# Altium project Capstone_SDR_PLUTOV2.PrjPcb (part 1 of 3)
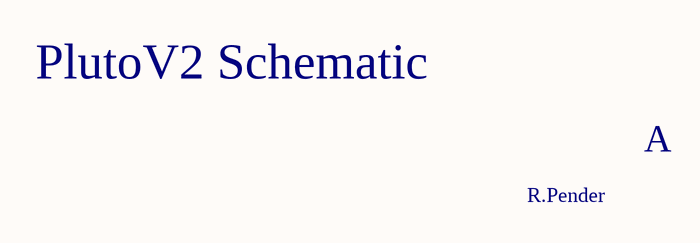
[diagram p0: Cover.SchDoc]
14 sheets, 439 parts. Net scope: global (net labels, ports and power ports of the same name join across sheets).
Sheets:
  Cover.SchDoc
  USB.SchDoc
  DDR3.SchDoc
  ZYNQ JTAG and Decoupling.SchDoc
  ZYNQ 34_35 and QPSI.SchDoc
  AD9363.SchDoc
  RF FRONTEND.SchDoc
  CONNECTORS_SELECTORS.SchDoc
  POWERREG.SchDoc
  POWERMANAGE.SchDoc
  POWERMANAGE2.SchDoc
  TESTPOINTS.SchDoc
  AD9363 OSCILLATORS.SchDoc
  RF Frontend 2.SchDoc

## Sheet Cover.SchDoc
size A3; SheetNumber: 1; SheetTotal: 2

### Notes on the sheet
- PlutoV2 Schematic
- A
- R.Pender

## Sheet USB.SchDoc
size A3; SheetNumber: 2; SheetTotal: 14; SPICEModelCacheQEWUXKYK: <root> / <DocumentId>QEWUXKYK</DocumentId> / </root>
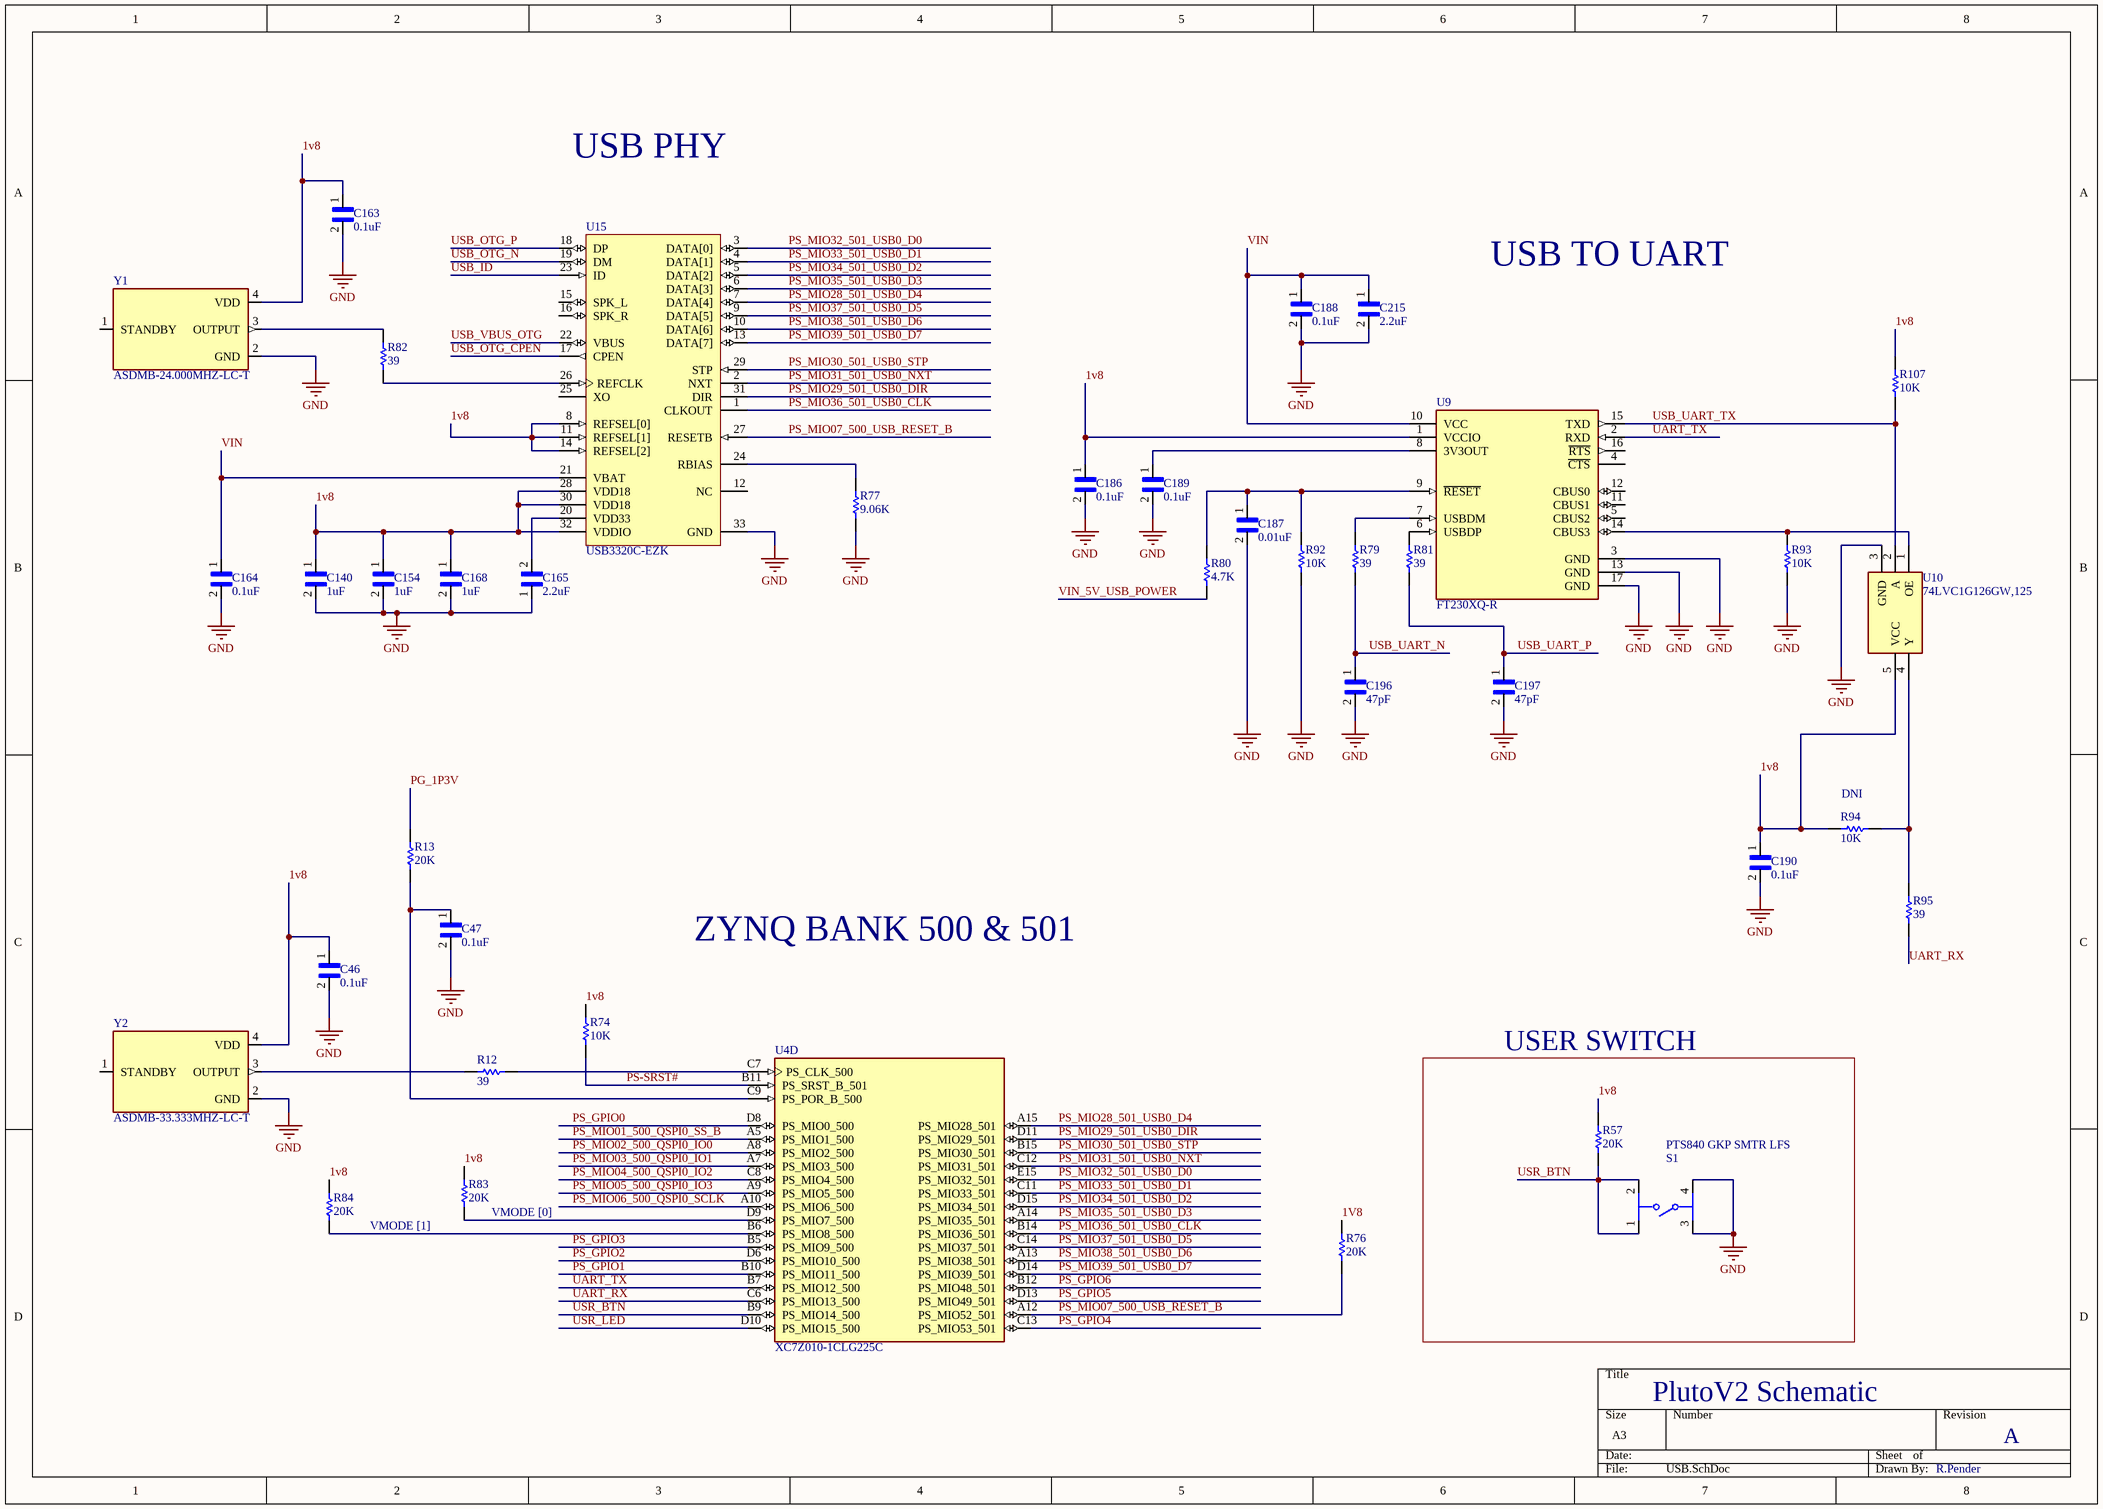
[diagram p1: USB.SchDoc]

### Parts
C46  0.1uF  [CAPC0603X33N]
C47  0.1uF  [CAPC0603X33N]
C140  1uF  [CAPC1005X55N]
C154  1uF  [CAPC1005X55N]
C163  0.1uF  [CAPC0603X33N]
C164  0.1uF  [CAPC0603X33N]
C165  2.2uF  [CAPC1608X100N]
C168  1uF  [CAPC1005X55N]
C186  0.1uF  [CAPC1005X55N]
C187  0.01uF  [CAPC0603X33N]
C188  0.1uF  [CAPC0603X33N]
C189  0.1uF  [CAPC0603X33N]
C190  0.1uF  [CAPC0603X33N]
C196  47pF  [CAPC1005X55N]
C197  47pF  [CAPC1005X55N]
C215  2.2uF  [CAPC1608X100N]
R12  39  [2-0402]
R13  20K  [2-0402]
R57  20K  [2-0402]
R74  10K  [2-0402]
R76  20K  [2-0402]
R77  9.06K  [2-0402]
R79  39  [2-0402]
R80  4.7K  [2-0402]
R81  39  [2-0402]
R82  39  [2-0402]
R83  20K  [2-0402]
R84  20K  [2-0402]
R92  10K  [2-0402]
R93  10K  [2-0402]
R94  10K  [2-0402]
R95  39  [2-0402]
R107  10K  [2-0402]
S1  PTS840 GKP SMTR LFS  [FP-PTS840_GKP_SMTR_LFS-MFG]
U4  XC7Z010-1CLG225C  [BGA225C80P15X15_1300X1300X150]  (part D of 6)
U9  FT230XQ-R  [FP-QFN-16-MFG]
U10  74LVC1G126GW,125  [SOT65P212X110-5N]
U15  USB3320C-EZK  [MCHP-QFN-32-5x5_V2]
Y1  ASDMB-24.000MHZ-LC-T  [XTAL_ASDMB-24.000MHZ-LC-T]
Y2  ASDMB-33.333MHZ-LC-T  [XTAL_ASDMB-24.000MHZ-LC-T]

### Blocks framed on the sheet
USER SWITCH: R57 S1

### Nets
GND: C46.2 C47.2 C140.2 C154.2 C163.2 C164.2 C165.1 C168.2 C186.2 C187.2 C188.2 C189.2 C190.2 C196.2 C197.2 C215.2 R77.1 R92.1 R93.2 S1.3 S1.4 U9.3(GND) U9.13(GND) U9.17(GND) U10.3(GND) U15.33(GND) Y1.2(GND) Y2.2(GND)
1v8: C46.1 C140.1 C154.1 C163.1 C168.1 C186.1 C190.1 R57.1 R74.2 R76.2 R83.1 R84.1 R94.2 R107.1 U9.1(VCCIO) U10.5(VCC) U15.8(REFSEL[0]) U15.11(REFSEL[1]) U15.14(REFSEL[2]) U15.28(VDD18) U15.30(VDD18) U15.32(VDDIO) Y1.4(VDD) Y2.4(VDD)
PG_1P3V: R13.2
PS-SRST#: R74.1 U4.B11(PS_SRST_B_501)
PS_GPIO0: U4.D8(PS_MIO0_500)
PS_GPIO1: U4.B10(PS_MIO11_500)
PS_GPIO2: U4.D6(PS_MIO10_500)
PS_GPIO3: U4.B5(PS_MIO9_500)
PS_GPIO4: U4.C13(PS_MIO53_501)
PS_GPIO5: U4.D13(PS_MIO49_501)
PS_GPIO6: U4.B12(PS_MIO48_501)
PS_MIO01_500_QSPI0_SS_B: U4.A5(PS_MIO1_500)
PS_MIO02_500_QSPI0_IO0: U4.A8(PS_MIO2_500)
PS_MIO03_500_QSPI0_IO1: U4.A7(PS_MIO3_500)
PS_MIO04_500_QSPI0_IO2: U4.C8(PS_MIO4_500)
PS_MIO05_500_QSPI0_IO3: U4.A9(PS_MIO5_500)
PS_MIO06_500_QSPI0_SCLK: U4.A10(PS_MIO6_500)
PS_MIO07_500_USB_RESET_B: R76.1 U4.A12(PS_MIO52_501) U15.27(RESETB)
PS_MIO28_501_USB0_D4: U4.A15(PS_MIO28_501) U15.7(DATA[4])
PS_MIO29_501_USB0_DIR: U4.D11(PS_MIO29_501) U15.31(DIR)
PS_MIO30_501_USB0_STP: U4.B15(PS_MIO30_501) U15.29(STP)
PS_MIO31_501_USB0_NXT: U4.C12(PS_MIO31_501) U15.2(NXT)
PS_MIO32_501_USB0_D0: U4.E15(PS_MIO32_501) U15.3(DATA[0])
PS_MIO33_501_USB0_D1: U4.C11(PS_MIO33_501) U15.4(DATA[1])
PS_MIO34_501_USB0_D2: U4.D15(PS_MIO34_501) U15.5(DATA[2])
PS_MIO35_501_USB0_D3: U4.A14(PS_MIO35_501) U15.6(DATA[3])
PS_MIO36_501_USB0_CLK: U4.B14(PS_MIO36_501) U15.1(CLKOUT)
PS_MIO37_501_USB0_D5: U4.C14(PS_MIO37_501) U15.9(DATA[5])
PS_MIO38_501_USB0_D6: U4.A13(PS_MIO38_501) U15.10(DATA[6])
PS_MIO39_501_USB0_D7: U4.D14(PS_MIO39_501) U15.13(DATA[7])
UART_RX: R95.2 U4.C6(PS_MIO13_500)
UART_TX: U4.B7(PS_MIO12_500) U9.2(RXD)
USB_ID: U15.23(ID)
USB_OTG_CPEN: U15.17(CPEN)
USB_OTG_N: U15.19(DM)
USB_OTG_P: U15.18(DP)
USB_UART_N: C196.1 R79.2
USB_UART_P: C197.1 R81.1
USB_UART_TX: R107.2 U9.15(TXD) U10.2(A)
USB_VBUS_OTG: U15.22(VBUS)
USR_BTN: R57.2 S1.1 S1.2 U4.B9(PS_MIO14_500)
USR_LED: U4.D10(PS_MIO15_500)
VIN: C164.1 C188.1 C215.1 U9.10(VCC) U15.21(VBAT)
VIN_5V_USB_POWER: R80.1
NetC47_1: C47.1 R13.1 U4.C9(PS_POR_B_500)
NetC165_2: C165.2 U15.20(VDD33)
NetC187_1: C187.1 R80.2 R92.2 U9.9(~{RESET})
NetC189_1: C189.1 U9.8(3V3OUT)
NetR12_1: R12.1 Y2.3(OUTPUT)
NetR12_2: R12.2 U4.C7(PS_CLK_500)
NetR77_2: R77.2 U15.24(RBIAS)
NetR79_1: R79.1 U9.7(USBDM)
NetR81_2: R81.2 U9.6(USBDP)
NetR82_1: R82.1 U15.26(REFCLK)
NetR82_2: R82.2 Y1.3(OUTPUT)
NetR83_2: R83.2 U4.D9(PS_MIO7_500)
NetR84_2: R84.2 U4.B6(PS_MIO8_500)
NetR93_1: R93.1 U9.14(CBUS3) U10.1(OE)
NetR94_1: R94.1 R95.1 U10.4(Y)

Not connected (* = marked no-connect by the designer): U9 4(~{CTS}) 5(CBUS2) 11(CBUS1) 12(CBUS0) 16(~{RTS}); U15 12(NC) 15(SPK_L) 16(SPK_R) 25(XO); Y1 1(STANDBY); Y2 1(STANDBY)

### Notes on the sheet
- USB PHY
- USB TO UART
- (near R94) DNI
- ZYNQ BANK 500 & 501
- VMODE [1]
- (near R83) VMODE [0]
- PlutoV2 Schematic
- A
- R.Pender

### Library data of the parts
C46 C47 C163 C164 C188-C190 = GRM033R61C104ME84D: CAP 0.1UF 16VDC X5R 20% SMD 0201 PAPER TAPE; Package: None; Price: None; Value: *; MP: GRM033R61C104ME84D; Availability: Unavailable
C140 C154 C168 C186 = EMK105BJ105KV-F: 1ÂµF Â± 10% 16V Condensateur cÃ©ramique X5R 0402 _1005 mÃ©trique_; MF: Taiyo Yuden; SnapEDA_Link: https://www.snapeda.com/parts/EMK105BJ105KV-F/Taiyo%20Yuden/view-part/1766709/?ref=snap; Digi-Key_Part_Number: 587-2477-1-ND; Package: 1005 Taiyo Yuden; Value: *; Digi-Key_Purchase_URL: https://www.digikey.com/product-detail/en/taiyo-yuden/EMK105BJ105KV-F/587-2477-1-ND/2230343?utm_source=snapeda&utm_medium=aggregator&utm_campaign=symbol; MP: EMK105BJ105KV-F
C165 C215 = GRM188R61H225KE11J: SMD Capacitor X5R(EIA) with Capacitance: 2.2uF Tol. 10%. Rated Voltage: 50Vdc; MF: Murata; Availability: Warning; Package: 1608 Murata; Purchase-URL: https://pricing.snapeda.com/search/part/GRM188R61H225KE11J/?ref=eda; MP: GRM188R61H225KE11J; SnapEDA_Link: https://www.snapeda.com/parts/GRM188R61H225KE11J/Murata/view-part/4377089/?ref=snap; Price: None; Check_prices: https://www.snapeda.com/parts/GRM188R61H225KE11J/Murata/view-part/4377089/?ref=eda; Value: *
C187 = GRM033R71A103KA01D: SMD Capacitor X7R(EIA) with Capacitance: 10000pF Tol. 10%. Rated Voltage: 10Vdc; MF: Murata; Package: 0603 Taiyo Yuden; MP: GRM033R71A103KA01D; Value: *; SnapEDA_Link: https://www.snapeda.com/parts/GRM033R71A103KA01D/Murata/view-part/4379446/?ref=snap; Availability: Unavailable; Price: None
C196 C197 = GCM1555C1H470JA16D: 47pF Â±5% 50V Ceramic Capacitor C0G, NP0 0402 (1005 Metric); MF: Murata; Purchase-URL: https://pricing.snapeda.com/search/part/GCM1555C1H470JA16D/?ref=eda; Package: 1005 Taiyo Yuden; MP: GCM1555C1H470JA16D; Value: *; SnapEDA_Link: https://www.snapeda.com/parts/GCM1555C1H470JA16D/Murata+Electronics+North+America/view-part/?ref=snap; Digi-Key_Part_Number: 490-10670-2-ND; Check_prices: https://www.snapeda.com/parts/GCM1555C1H470JA16D/Murata+Electronics+North+America/view-part/?ref=eda
R12 R79 R81 R82 R95 = ERJ2GE: Thick Film Chip Resistor, 1 Ohm to 2.2M Ohm Range, 5% Tolerance, 0402 Size, 0.063 W; Note: If flow soldering, adjust pad width of PCB Footprint to 0.7 - 0.8 times the width of the resistor.; Published: 17-Dec-2003; LatestRevisionDate: 19-Mar-2004; LatestRevisionNote: Silkscreen size reduced.; PackageDocument: Mar-2003; PackageReference: 2-0402; Publisher: Altium Limited; Code_IPC: 1005 [0402]; ComponentLink1Description: Manufacturer Link; ComponentLink1URL: http://www.panasonic.com/industrial/components/resistive_products.htm; ComponentLink2Description: Datasheet; ComponentLink2URL: http://www.panasonic.com/industrial/components/pdf/AOA0000CE1.pdf
R13 R57 R74 R76 R77 R80 R83 R84 R92-R94 R107 = ERJ2RK: Precision Thick Film Chip Resistor, 10 Ohm to 1M Ohm Range, 1% and 0.5% Tolerance, 0402 Size, 0.063 W; Published: 17-Dec-2003; LatestRevisionDate: 19-Mar-2004; LatestRevisionNote: Silkscreen size reduced.; PackageDocument: Mar-2003; PackageReference: 2-0402; Publisher: Altium Limited; Code_IPC: 1005 [0402]; ComponentLink1Description: Manufacturer Link; ComponentLink1URL: http://www.panasonic.com/industrial/components/resistive_products.htm; ComponentLink2Description: Datasheet; ComponentLink2URL: http://www.panasonic.com/industrial/components/pdf/AOA0000CE2.pdf
S1 = CMP-10040-000012-1: SWITCH TACTILE SPST-NO 0.05A 12V; Manufacturer: C&K Components; Electromechanical Life: 100000Cycles; Contact Current Rating: 50mA; Operating Force: 220gf; Standoff Height: 0mm; Contact Resistance: 500mΩ; Temperature Range High: +85°C; Automotive: No; Height: 1.35mm; Lead Free: Yes; Device Class L1: Electromechanical; Temperature: -40°C to +85°C; Digikey Description: SWITCH TACTILE SPST-NO 0.05A 12V; ComponentLink2Description: Datasheet; Category: Switch; Temperature Range Low: -40°C; Manufacturer Part Number: PTS840 GKP SMTR LFS; Throw Configuration: SPST-NO; Package: PTS840 GKP SMTR LFS; Device Class L2: Switches; Mouser Description: Tactile Switches; Voltage Rating Dc: 12V; ComponentLink2URL: https://www.ckswitches.com/media/1477/pts840.pdf; Octopart: https://octopart.com/pts840gkpsmtrlfs-c%26k+components-29380303; Device Class L3: Tactile Switches; RoHS: TRUE
U4 = XC7Z010-1CLG225C: Dual ARMÂ® CortexÂ®-A9 MPCoreâ„¢ with CoreSightâ„¢ System On Chip _SOC_ IC ZynqÂ®-7000 Artixâ„¢-7 FPGA, 28K Logic Cells 667MHz 225-CSPBGA _13x13_; MF: Xilinx Inc.; Value: *; SnapEDA_Link: https://www.snapeda.com/parts/XC7Z010-1CLG225C/Xilinx%20Inc./view-part/45778/?ref=snap; Digi-Key_Part_Number: 122-1855-ND; Package: CSPBGA-225 Xilinx; Digi-Key_Purchase_URL: https://www.digikey.by/product-detail/en/xilinx-inc/XC7Z010-1CLG225C/122-1855-ND/3925788?utm_source=snapeda&utm_medium=aggregator&utm_campaign=symbol; MP: XC7Z010-1CLG225C
U9 = CMP-0248-00010-3: IC USB SERIAL BASIC UART 16QFN; Number of Channels: 1; Data Rate: 12Mbps; Operating Supply Current: 8mA; Max Supply Voltage: 5.5V; Operating Supply Voltage: 5V; Min Supply Voltage: 2.97V; Width: 4mm; Length: 4mm; Height: 0.75mm; Max Operating Temperature: 85°C; Interface: USB; Min Operating Temperature: -40°C; Package Quantity: 5000; Lead Free: Lead Free; Number of Pins: 16; Case/Package: QFN; Weight: 0.002014oz; Packaging: Tape and Reel; Mount: Surface Mount
U10 = 74LVC1G126GW,125: Integrated Circuit; Manufacturer_Name: Nexperia; Datasheet Link: https://assets.nexperia.com/documents/data-sheet/74LVC1G126.pdf; Height: 1.1mm; Manufacturer_Part_Number: 74LVC1G126GW,125
U15 = CMP-0186-00335-1: Highly Integrated Full Featured Hi-Speed USB 2.0 ULPI Transceiver, 1.8 to 3.3 V, -40 to 85 degC, 32-Pin QFN (QFN-3304), RoHS, Tray; Manufacturer: Microchip; VVBAT: 3.1 to 5.5 V; REFCLK Frequency@ULPI Input Clock Mode: 60 MHz; Cpin: 4 pF Max.; VDD33: 3 to 3.6 V; Mounting Technology: Surface Mount; I/O Voltage: 1.8 to 3.3 V; ComponentLink3URL: http://ww1.microchip.com/downloads/en/DeviceDoc/00001792A.pdf; PackageDescription: 32-Pin Quad Flat Non-Leaded Package, Body 5 x 5 mm, Pitch 0.5 mm; ComponentLink2URL: http://ww1.microchip.com/downloads/en/DeviceDoc/00001792A.pdf; Temperature Range: -40 to 85 degC; ComponentLink2Description: Datasheet; ComponentLink1URL: www.microchip.com/; ComponentLink3Description: Package Specification; Packing: Tray; ComponentLink1Description: Manufacturer URL; PartNumber: USB3320C-EZK; PackageVersion: Rev. H; DatasheetVersion: DS00001792A; RoHS: TRUE
Y1 Y2 = ASDMB-24.000MHZ-LC-T: 24MHz XO _Standard_ LVCMOS Oscillator 1.8V ~ 3.3V Standby _Power Down_ 4-SMD, No Lead; MF: Abracon LLC; Availability: Unavailable; SnapEDA_Link: https://www.snapeda.com/parts/ASDMB-24.000MHZ-LC-T/Abracon%20LLC/view-part/339168/?ref=snap; Price: None; Value: *; MP: ASDMB-24.000MHZ-LC-T; Package: SMD-4 Abracon LLC

## Sheet DDR3.SchDoc
size A3; SheetNumber: 3; SheetTotal: 13; SPICEModelCacheAHASEUHE: <root> / <DocumentId>AHASEUHE</DocumentId> / </root>
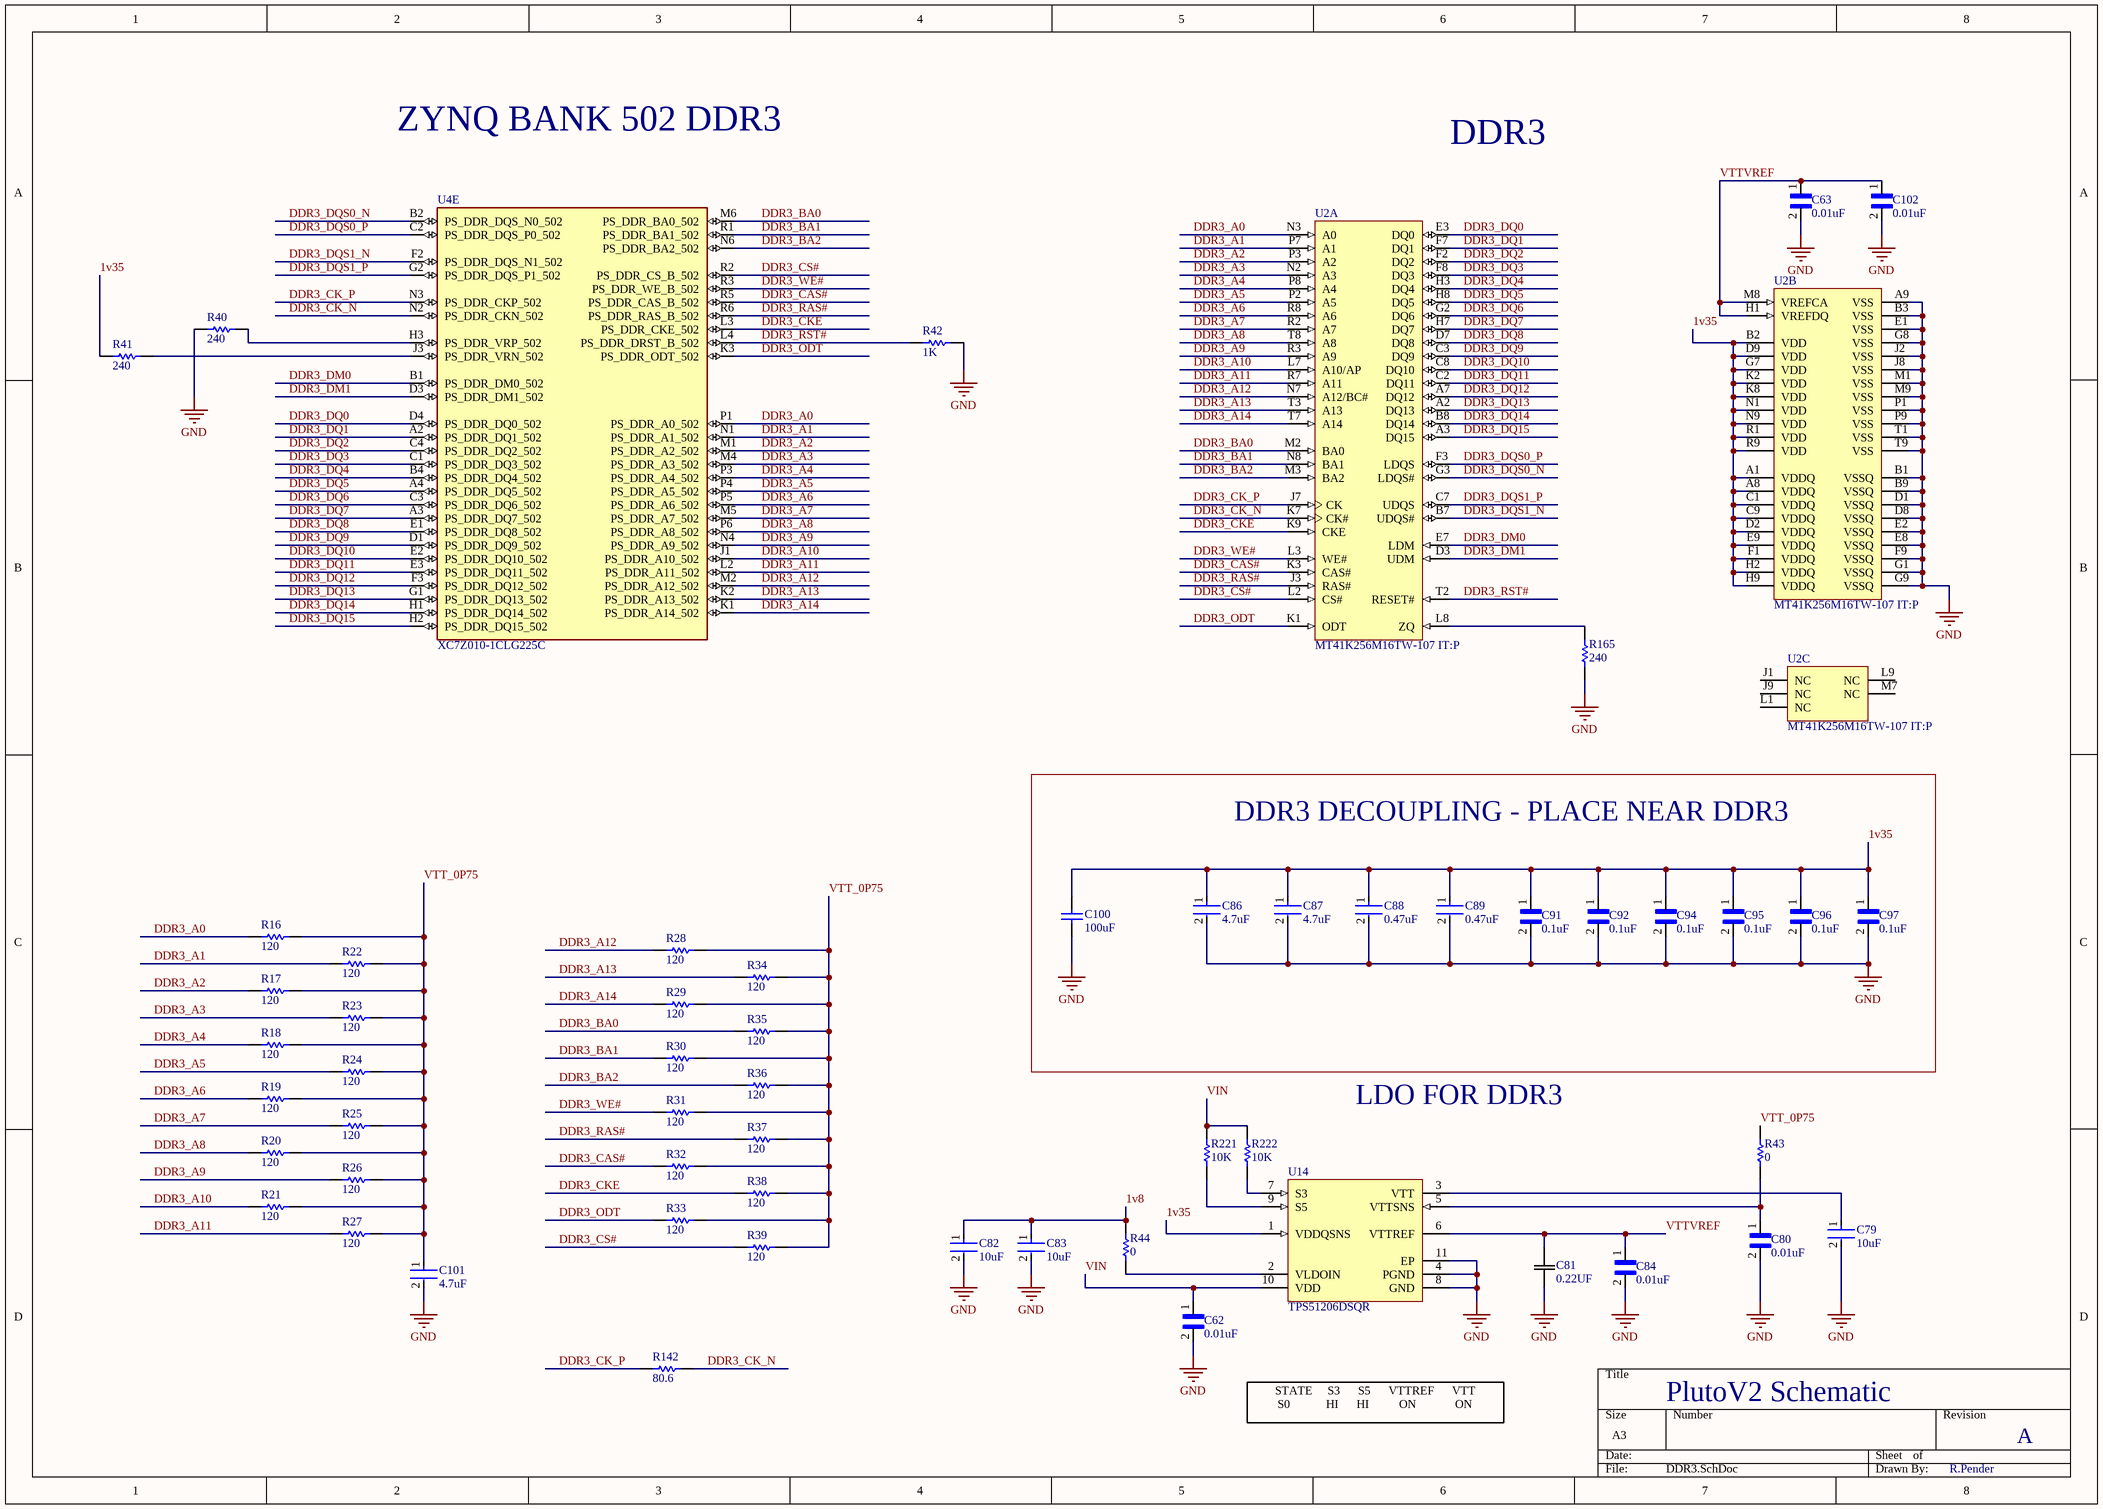
[diagram p2: DDR3.SchDoc]

### Parts
C62  0.01uF  [CAPC0603X33N]
C63  0.01uF  [CAPC0603X33N]
C79  10uF  [FP-GRM188-0_1-e0_2_0_55-IPC_A]
C80  0.01uF  [CAPC0603X33N]
C81  0.22UF  [CAP_U_0805_KNO]
C82  10uF  [FP-GRM188-0_1-e0_2_0_55-IPC_A]
C83  10uF  [FP-GRM188-0_1-e0_2_0_55-IPC_A]
C84  0.01uF  [CAPC0603X33N]
C86  4.7uF  [FP-C1005-050-0_15-MFG]
C87  4.7uF  [FP-C1005-050-0_15-MFG]
C88  0.47uF  [FP-C1005-050-0_15-MFG]
C89  0.47uF  [FP-C1005-050-0_15-MFG]
C91  0.1uF  [CAPC0603X33N]
C92  0.1uF  [CAPC0603X33N]
C94  0.1uF  [CAPC0603X33N]
C95  0.1uF  [CAPC0603X33N]
C96  0.1uF  [CAPC0603X33N]
C97  0.1uF  [CAPC0603X33N]
C100  100uF  [CAPC3216X190X55ML30T25]
C101  4.7uF  [FP-C1005-050-0_15-MFG]
C102  0.01uF  [CAPC0603X33N]
R16  120  [1-0201]
R17  120  [1-0201]
R18  120  [1-0201]
R19  120  [1-0201]
R20  120  [1-0201]
R21  120  [1-0201]
R22  120  [1-0201]
R23  120  [1-0201]
R24  120  [1-0201]
R25  120  [1-0201]
R26  120  [1-0201]
R27  120  [1-0201]
R28  120  [1-0201]
R29  120  [1-0201]
R30  120  [1-0201]
R31  120  [1-0201]
R32  120  [1-0201]
R33  120  [1-0201]
R34  120  [1-0201]
R35  120  [1-0201]
R36  120  [1-0201]
R37  120  [1-0201]
R38  120  [1-0201]
R39  120  [1-0201]
R40  240  [2-0402]
R41  240  [2-0402]
R42  1K  [2-0402]
R43  0  [RESC1005X40X25NL10T10]
R44  0  [RESC1005X40X25NL10T10]
R142  80.6  [2-0402]
R165  240  [2-0402]
R221  10K  [2-0402]
R222  10K  [2-0402]
U2  MT41K256M16TW-107 IT:P  [MICT-TW-96]  (parts A,B,C of 3)
U4  XC7Z010-1CLG225C  [BGA225C80P15X15_1300X1300X150]  (part E of 6)
U14  TPS51206DSQR  [DSQ0010A_V]

### Blocks framed on the sheet
DDR3 DECOUPLING - PLACE NEAR DDR3: C86-C89 C91 C92 C94-C97 C100

### Nets
GND: C62.2 C63.2 C79.2 C80.2 C81.2 C82.2 C83.2 C84.2 C86.2 C87.2 C88.2 C89.2 C91.2 C92.2 C94.2 C95.2 C96.2 C97.2 C100.2 C101.2 C102.2 R40.1 R42.2 R165.2 U2.A9(VSS) U2.B1(VSSQ) U2.B3(VSS) U2.B9(VSSQ) U2.D1(VSSQ) U2.D8(VSSQ) U2.E1(VSS) U2.E2(VSSQ) U2.E8(VSSQ) U2.F9(VSSQ) U2.G1(VSSQ) U2.G8(VSS) U2.G9(VSSQ) U2.J2(VSS) U2.J8(VSS) U2.M1(VSS) U2.M9(VSS) U2.P1(VSS) U2.P9(VSS) U2.T1(VSS) U2.T9(VSS) U14.4(PGND) U14.8(GND) U14.11(EP)
1v8: C82.1 C83.1 R44.1
1v35: C86.1 C87.1 C88.1 C89.1 C91.1 C92.1 C94.1 C95.1 C96.1 C97.1 C100.1 R41.1 U2.A1(VDDQ) U2.A8(VDDQ) U2.B2(VDD) U2.C1(VDDQ) U2.C9(VDDQ) U2.D2(VDDQ) U2.D9(VDD) U2.E9(VDDQ) U2.F1(VDDQ) U2.G7(VDD) U2.H2(VDDQ) U2.H9(VDDQ) U2.K2(VDD) U2.K8(VDD) U2.N1(VDD) U2.N9(VDD) U2.R1(VDD) U2.R9(VDD) U14.1(VDDQSNS)
DDR3_A0: R16.1 U2.N3(A0) U4.P1(PS_DDR_A0_502)
DDR3_A1: R22.1 U2.P7(A1) U4.N1(PS_DDR_A1_502)
DDR3_A2: R17.1 U2.P3(A2) U4.M1(PS_DDR_A2_502)
DDR3_A3: R23.1 U2.N2(A3) U4.M4(PS_DDR_A3_502)
DDR3_A4: R18.1 U2.P8(A4) U4.P3(PS_DDR_A4_502)
DDR3_A5: R24.1 U2.P2(A5) U4.P4(PS_DDR_A5_502)
DDR3_A6: R19.1 U2.R8(A6) U4.P5(PS_DDR_A6_502)
DDR3_A7: R25.1 U2.R2(A7) U4.M5(PS_DDR_A7_502)
DDR3_A8: R20.1 U2.T8(A8) U4.P6(PS_DDR_A8_502)
DDR3_A9: R26.1 U2.R3(A9) U4.N4(PS_DDR_A9_502)
DDR3_A10: R21.1 U2.L7(A10/AP) U4.J1(PS_DDR_A10_502)
DDR3_A11: R27.1 U2.R7(A11) U4.L2(PS_DDR_A11_502)
DDR3_A12: R28.1 U2.N7(A12/BC#) U4.M2(PS_DDR_A12_502)
DDR3_A13: R34.1 U2.T3(A13) U4.K2(PS_DDR_A13_502)
DDR3_A14: R29.1 U2.T7(A14) U4.K1(PS_DDR_A14_502)
DDR3_BA0: R35.1 U2.M2(BA0) U4.M6(PS_DDR_BA0_502)
DDR3_BA1: R30.1 U2.N8(BA1) U4.R1(PS_DDR_BA1_502)
DDR3_BA2: R36.1 U2.M3(BA2) U4.N6(PS_DDR_BA2_502)
DDR3_CAS#: R32.1 U2.K3(CAS#) U4.R5(PS_DDR_CAS_B_502)
DDR3_CK_N: R142.2 U2.K7(CK#) U4.N2(PS_DDR_CKN_502)
DDR3_CK_P: R142.1 U2.J7(CK) U4.N3(PS_DDR_CKP_502)
DDR3_CKE: R38.1 U2.K9(CKE) U4.L3(PS_DDR_CKE_502)
DDR3_CS#: R39.1 U2.L2(CS#) U4.R2(PS_DDR_CS_B_502)
DDR3_DM0: U2.E7(LDM) U4.B1(PS_DDR_DM0_502)
DDR3_DM1: U2.D3(UDM) U4.D3(PS_DDR_DM1_502)
DDR3_DQ0: U2.E3(DQ0) U4.D4(PS_DDR_DQ0_502)
DDR3_DQ1: U2.F7(DQ1) U4.A2(PS_DDR_DQ1_502)
DDR3_DQ2: U2.F2(DQ2) U4.C4(PS_DDR_DQ2_502)
DDR3_DQ3: U2.F8(DQ3) U4.C1(PS_DDR_DQ3_502)
DDR3_DQ4: U2.H3(DQ4) U4.B4(PS_DDR_DQ4_502)
DDR3_DQ5: U2.H8(DQ5) U4.A4(PS_DDR_DQ5_502)
DDR3_DQ6: U2.G2(DQ6) U4.C3(PS_DDR_DQ6_502)
DDR3_DQ7: U2.H7(DQ7) U4.A3(PS_DDR_DQ7_502)
DDR3_DQ8: U2.D7(DQ8) U4.E1(PS_DDR_DQ8_502)
DDR3_DQ9: U2.C3(DQ9) U4.D1(PS_DDR_DQ9_502)
DDR3_DQ10: U2.C8(DQ10) U4.E2(PS_DDR_DQ10_502)
DDR3_DQ11: U2.C2(DQ11) U4.E3(PS_DDR_DQ11_502)
DDR3_DQ12: U2.A7(DQ12) U4.F3(PS_DDR_DQ12_502)
DDR3_DQ13: U2.A2(DQ13) U4.G1(PS_DDR_DQ13_502)
DDR3_DQ14: U2.B8(DQ14) U4.H1(PS_DDR_DQ14_502)
DDR3_DQ15: U2.A3(DQ15) U4.H2(PS_DDR_DQ15_502)
DDR3_DQS0_N: U2.G3(LDQS#) U4.B2(PS_DDR_DQS_N0_502)
DDR3_DQS0_P: U2.F3(LDQS) U4.C2(PS_DDR_DQS_P0_502)
DDR3_DQS1_N: U2.B7(UDQS#) U4.F2(PS_DDR_DQS_N1_502)
DDR3_DQS1_P: U2.C7(UDQS) U4.G2(PS_DDR_DQS_P1_502)
DDR3_ODT: R33.1 U2.K1(ODT) U4.K3(PS_DDR_ODT_502)
DDR3_RAS#: R37.1 U2.J3(RAS#) U4.R6(PS_DDR_RAS_B_502)
DDR3_RST#: R42.1 U2.T2(RESET#) U4.L4(PS_DDR_DRST_B_502)
DDR3_WE#: R31.1 U2.L3(WE#) U4.R3(PS_DDR_WE_B_502)
VIN: C62.1 R221.1 R222.1 U14.10(VDD)
VTT_0P75: C101.1 R16.2 R17.2 R18.2 R19.2 R20.2 R21.2 R22.2 R23.2 R24.2 R25.2 R26.2 R27.2 R28.2 R29.2 R30.2 R31.2 R32.2 R33.2 R34.2 R35.2 R36.2 R37.2 R38.2 R39.2 R43.1
VTTVREF: C63.1 C81.1 C84.1 C102.1 U2.H1(VREFDQ) U2.M8(VREFCA) U14.6(VTTREF)
NetC79_1: C79.1 U14.3(VTT)
NetC80_1: C80.1 R43.2 U14.5(VTTSNS)
NetR40_2: R40.2 U4.H3(PS_DDR_VRP_502)
NetR41_2: R41.2 U4.J3(PS_DDR_VRN_502)
NetR44_2: R44.2 U14.2(VLDOIN)
NetR165_1: R165.1 U2.L8(ZQ)
NetR221_2: R221.2 U14.9(S5)
NetR222_2: R222.2 U14.7(S3)

Not connected (* = marked no-connect by the designer): U2 J1(NC) J9(NC) L1(NC) L9(NC) M7(NC)

### Notes on the sheet
- ZYNQ BANK 502 DDR3
- DDR3
- LDO FOR DDR3
- STATE     S3      S5      VTTREF      VTT                                       S0            HI      HI          ON             ON
- PlutoV2 Schematic
- A
- R.Pender

### Library data of the parts
C62 C63 C80 C84 C102 = GRM033R71A103KA01D: as C187 on sheet USB; Package: 0603 Taiyo Yuden; MP: GRM033R71A103KA01D; Value: *; SnapEDA_Link: https://www.snapeda.com/parts/GRM033R71A103KA01D/Murata/view-part/4379446/?ref=snap; Availability: Unavailable; Price: None; Check_prices: https://www.snapeda.com/parts/GRM033R71A103KA01D/Murata/view-part/4379446/?ref=eda
C79 C82 C83 = CMP-2006-02792-2: Chip Multilayer Ceramic Capacitors for General Purpose, 0603, 10uF, X5R, 15%, 20%, 6.3V; Packaging: Tape and Reel; Voltage Rating (DC): 6.3V; Width: 0.031inch; Termination: SMD/SMT; Dielectric: X5R; Package Quantity: 4000; Voltage Rating: 6.3V; Capacitance: 10uF; Case/Package: 0603; Min Operating Temperature: -55°C; Voltage: 6.3V; Length: 1.6mm; Thickness: 0.035inch; Lead Free: Lead Free; Depth: 0.8mm; Case Code (Imperial): 0603; Max Operating Temperature: 85°C; Material: Ceramic; Height: 0.8mm; Tolerance: 20%; Mount: Surface Mount; REACH SVHC: No SVHC; Radiation Hardening: No; Case Code (Metric): 1608
C81 = 080530250224KXT: No Description Available; Mfr_Name: Knowles; Type: DEV; Copyright: Copyright (C) 2022 Ultra Librarian. All rights reserved.; Manufacturer_Part_Number: 080530250224KXT; Digi-Key_Part_Number_1: 1608-1296-2-ND; Digi-Key_Part_Number_2: 1608-1296-1-ND; Digi-Key_Part_Number_3: 1608-1296-6-ND; RefDes: RefDes
C86-C89 C101 = CMP-2000-05437-2: CAP CER 4.7UF 6.3V X5R 0402; Tolerance: 10%; Dielectric Material: Ceramic; Voltage: 6.3V; Capacitance: 4.7uF; Depth: 0.5mm; Height: 0.5mm; Length: 1mm; Termination: SMD/SMT; RoHS Compliant: Yes; Series: C; Case/Package: 0402; Dielectric: X5R; Lead Free: Lead Free; Mount: Surface Mount; Max Operating Temperature: 85°C; Min Operating Temperature: -55°C
C91 C92 C94-C97 = GRM033R61C104ME84D: as C46 on sheet USB; Package: None; Price: None; Value: *; MP: GRM033R61C104ME84D; Availability: Unavailable
C100 = CMP-1662-00011-2: Chip Capacitor, 100 uF, +/- 20%, 6.3 V, -55 to 85 degC, 1206 (3216 Metric), RoHS, Tape and Reel; PartNumber: GRM31CR60J107ME39L; Case\/Package: 1206; Voltage Rating (DC): 6.3 V; Type (Capacitors): X5R; REACH SVHC: No SVHC; Height: 1.6 mm; Tolerance: 20%; Packaging: Tape and Reel; Mount: Surface Mount; PackageDescription: 2-Pin Surface Mount Device, Body 3.2 x 1.6 mm; ComponentLink1URL: http://www.murata.com/; Pins: 2; ComponentLink2Description: Datasheet; PackageReference: 1206; Width: 1.6 mm; Package Quantity: 2000; Capacitance: 100 uF; Min Operating Temperature: -55 degC; Case Code (Imperial): 1206; Max Operating Temperature: 85 degC; DatasheetVersion: 09/2016; Mounting Technology: Surface Mount; Voltage Rating: 6.3 V; ComponentLink1Description: Manufacturer URL; Radiation Hardening: No; Case Code (Metric): 3216; Length: 3.2 mm; ComponentLink2URL: http://psearch.en.murata.com/capacitor/product/GRM31CR60J107ME39%23.pdf; RoHSCompliant: true
R16-R39 = ERJ1GE: Thick Film Chip Resistor, 10 Ohm to 1M Ohm Range, 5% Tolerance, 0201 Size, 0.05 W; Note: If flow soldering, adjust pad width of PCB Footprint to 0.7 - 0.8 times the width of the resistor.; Published: 17-Dec-2003; LatestRevisionDate: 19-Mar-2004; LatestRevisionNote: Silkscreen size reduced.; PackageDocument: Mar-2003; PackageReference: 1-0201; Publisher: Altium Limited; ComponentLink1Description: Manufacturer Link; ComponentLink1URL: http://www.panasonic.com/industrial/components/resistive_products.htm; ComponentLink2Description: Datasheet; ComponentLink2URL: http://www.panasonic.com/industrial/components/pdf/AOA0000CE1.pdf
R40-R42 R142 R165 R221 R222 = ERJ2RK: as R13 on sheet USB; Published: 17-Dec-2003; LatestRevisionDate: 19-Mar-2004; LatestRevisionNote: Silkscreen size reduced.; PackageDocument: Mar-2003; PackageReference: 2-0402; Publisher: Altium Limited; Code_IPC: 1005 [0402]; ComponentLink1Description: Manufacturer Link; ComponentLink1URL: http://www.panasonic.com/industrial/components/resistive_products.htm; ComponentLink2Description: Datasheet; ComponentLink2URL: http://www.panasonic.com/industrial/components/pdf/AOA0000CE2.pdf
R43 R44 = CMP-2002-05896-1: Part Number: MC00625W040210R; Manufacturer: Multicomp
U2 = CMP-2000-06773-2: Automotive DDR3L SDRAM, 4 GB, 933 MHz, 1.283 to 1.45 V, -40 to 95 degC, 96-Pin TFBGA, RoHS, Tray; Manufacturer: Micron; Data Bus Width: 16b; Address Bus Width: 15b; Operating Supply Voltage: 1.35V; Access Time: 1.07ns; Max Frequency: 933MHz; Density: 4Gb; Package Reference: TW-96; Max Operating Temperature: 95degC; RoHSCompliant: true; Datasheet Version: Rev. D, 02/2017; Datasheet URL: https://www.micron.com/~/media/documents/products/data-sheet/dram/ddr3/4gb_automotive_ddr3l.pdf; Mount: SurfaceMount; Min Operating Temperature: -40degC; Package Description: 96-Ball Fine Pitch Ball Grid Array, Body 14 x 8 mm, Pitch 0.8 mm; Mounting Technology: SurfaceMount; Contact Plating: Silver; Manufacturer URL: http://www.micron.com/
U4 = XC7Z010-1CLG225C: as U4 on sheet USB; Value: *; SnapEDA_Link: https://www.snapeda.com/parts/XC7Z010-1CLG225C/Xilinx%20Inc./view-part/45778/?ref=snap; Digi-Key_Part_Number: 122-1855-ND; Package: CSPBGA-225 Xilinx; Digi-Key_Purchase_URL: https://www.digikey.by/product-detail/en/xilinx-inc/XC7Z010-1CLG225C/122-1855-ND/3925788?utm_source=snapeda&utm_medium=aggregator&utm_campaign=symbol; MP: XC7Z010-1CLG225C
U14 = CMP-0395-00678-2: Single Output LDO, 2 A, with VTTREF Buffered Reference for DDR2, DDR3, DDR3L, 10-pin SON (DSQ), -40 to 85 degC, Green (RoHS & no Sb/Br); Manufacturer: Texas Instruments; SubFamily: Single Channel LDO; Iout(Max)(A): 2; Rating: Catalog; ComponentLink2Description: Datasheet; ComponentLink1URL: http://www.ti.com/; ComponentLink4URL: Samples URL:http://www.ti.com/product/tps51206#samples; PackageVersion: 4209243/B; Mounting Technology: Surface Mount; PackageReference: DSQ0010A; Eco-Plan: Green (RoHS & no Sb/Br); PackageDescription: 10-Pin Plastic Small Outline, Body 2 X 2 mm, Pitch 0.4 mm; ComponentLink4Description: URL Link1; DatasheetVersion: SLUSAH1; ComponentLink3URL: http://www.ti.com/litv/pdf/mpdi002c; ComponentLink2URL: http://www.ti.com/general/docs/lit/getliterature.tsp?genericPartNumber=TPS51206&fileType=pdf; PartNumber: TPS51206DSQR; ComponentLink3Description: Package Specification; ComponentLink1Description: Manufacturer URL

## Sheet ZYNQ JTAG and Decoupling.SchDoc
size A3; SheetNumber: 4; SheetTotal: 14; SPICEModelCacheIAXUMUHC: <root> / <DocumentId>IAXUMUHC</DocumentId> / <CacheFrame Number="0"> / <Model Name="led3" Kind="MDL"> / <Text>*Typ BLUE SiC LED: Vf=3.4V Vr=5V If=40mA trr=3uS / *LED Pinout: 1=A, 2=K / .MODEL LED3 D (IS=93.1P RS=42M N=7.47 BV=5 IBV=30U / + CJO=2.97P VJ=.75 M=.333 TT=4.32U)</Text> / </Model> / </CacheFrame> / </root>
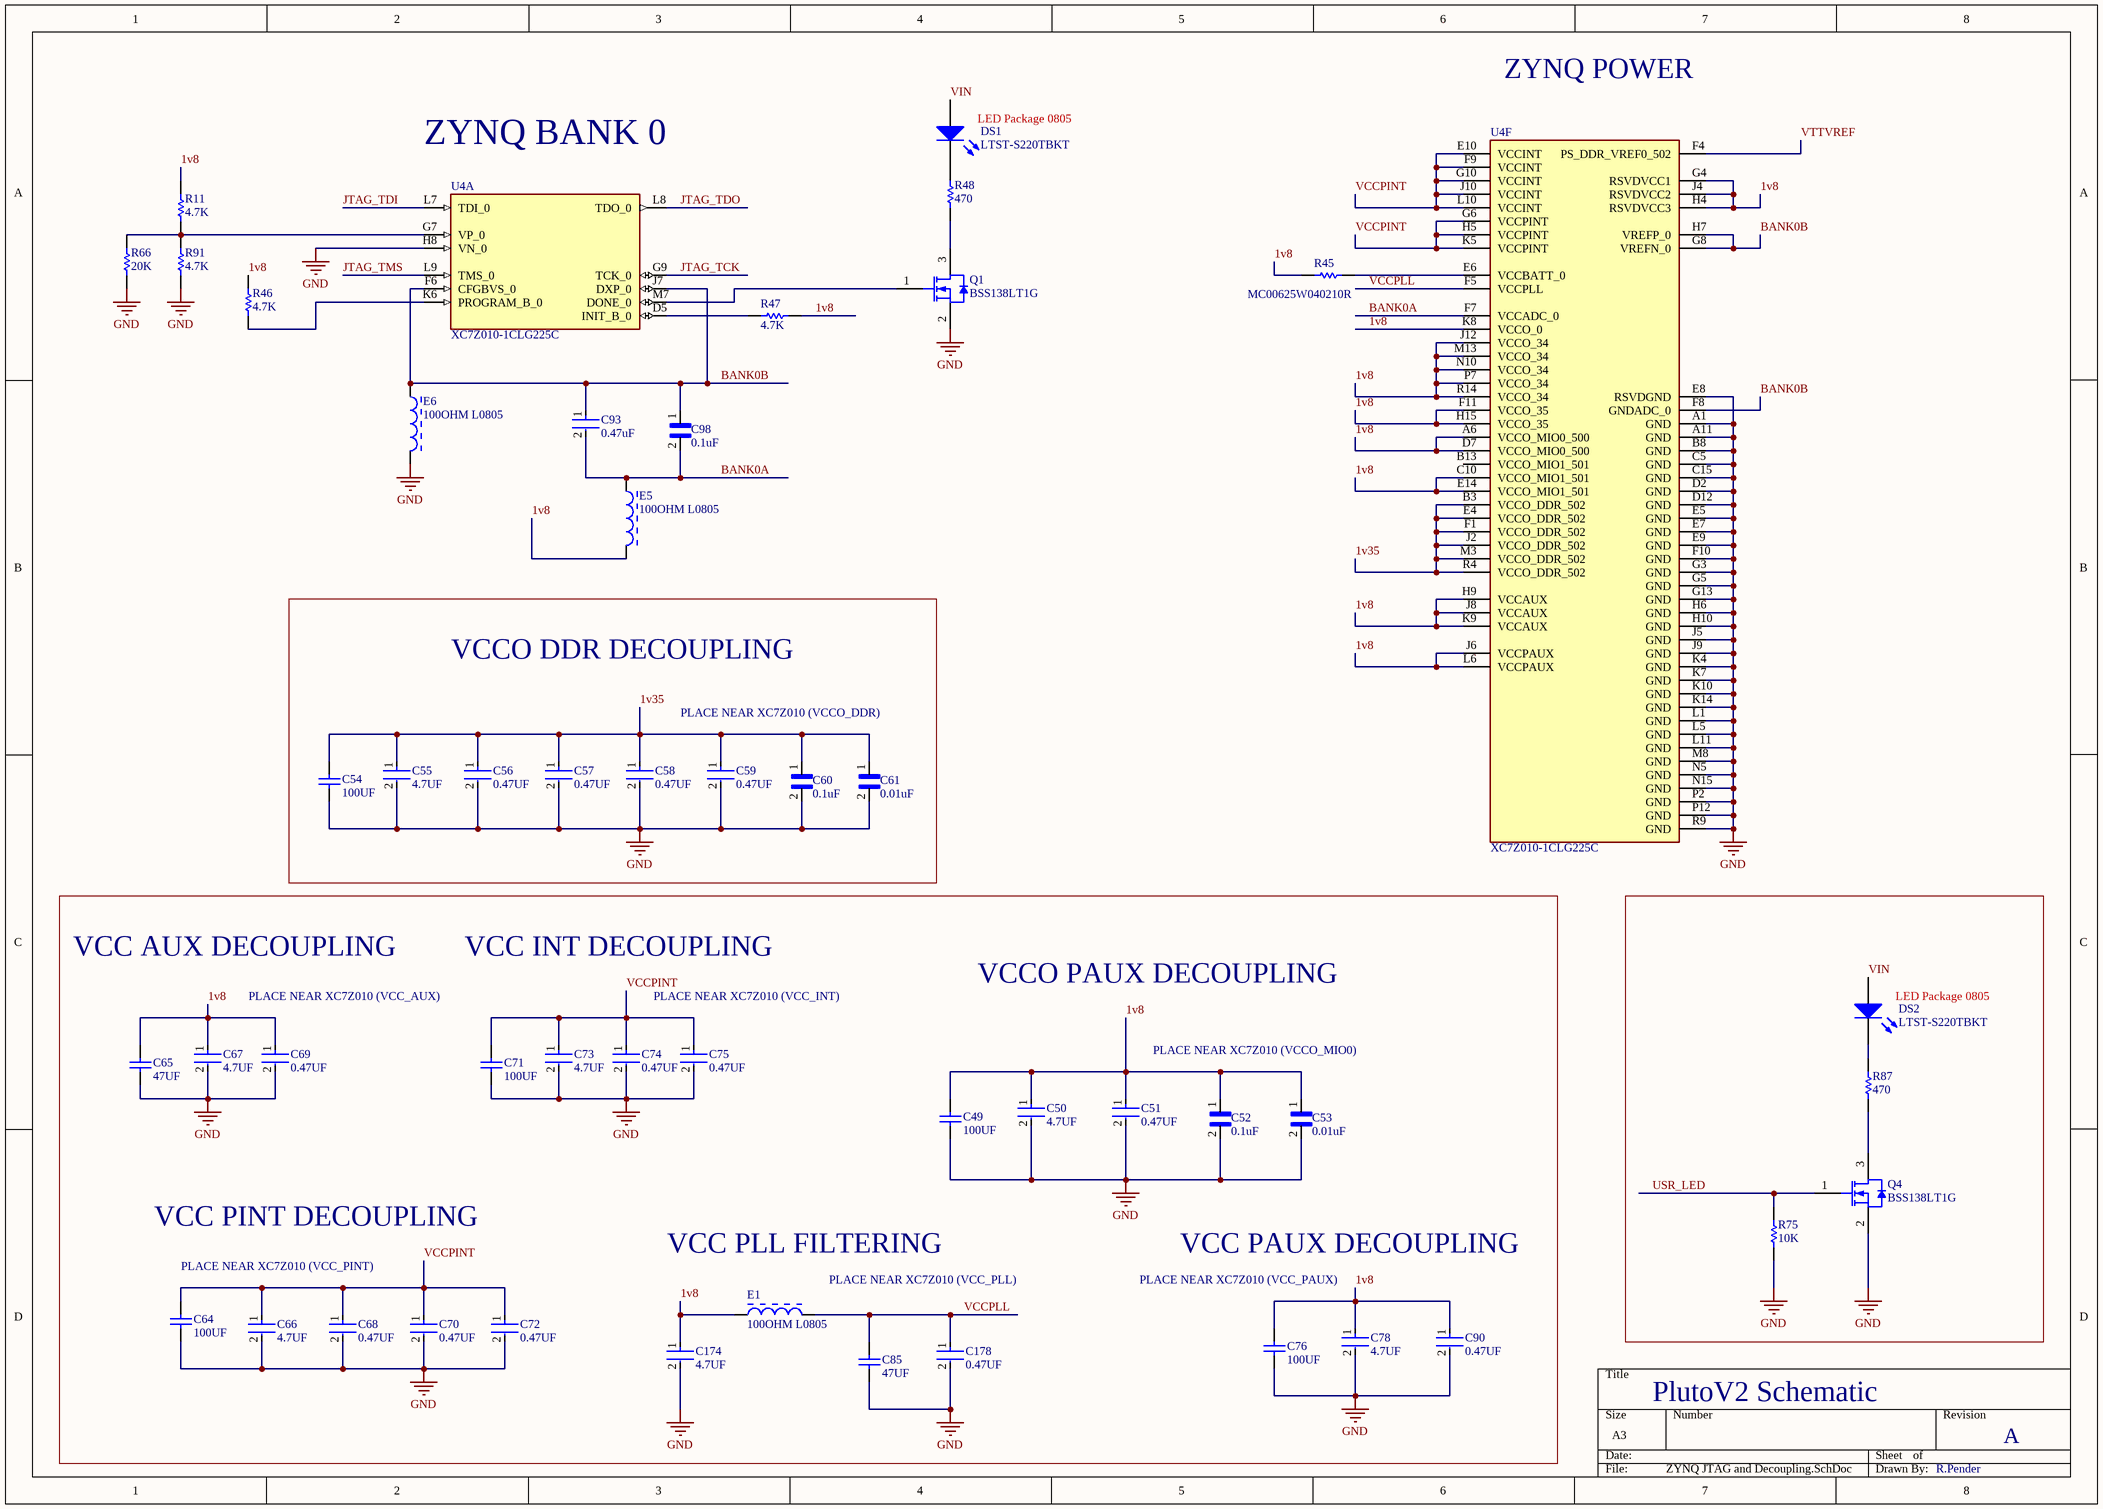
[diagram p3: ZYNQ JTAG and Decoupling.SchDoc]

### Parts
C49  100UF  [CAPC3216X190X55ML30T25]
C50  4.7UF  [FP-C1005-050-0_15-MFG]
C51  0.47UF  [FP-C1005-050-0_15-MFG]
C52  0.1uF  [CAPC0603X33N]
C53  0.01uF  [CAPC0603X33N]
C54  100UF  [CAPC3216X190X55ML30T25]
C55  4.7UF  [FP-C1005-050-0_15-MFG]
C56  0.47UF  [FP-C1005-050-0_15-MFG]
C57  0.47UF  [FP-C1005-050-0_15-MFG]
C58  0.47UF  [FP-C1005-050-0_15-MFG]
C59  0.47UF  [FP-C1005-050-0_15-MFG]
C60  0.1uF  [CAPC0603X33N]
C61  0.01uF  [CAPC0603X33N]
C64  100UF  [CAPC3216X190X55ML30T25]
C65  47UF  [TAYO-JMK212BBJ476MG-T_L]
C66  4.7UF  [FP-C1005-050-0_15-MFG]
C67  4.7UF  [FP-C1005-050-0_15-MFG]
C68  0.47UF  [FP-C1005-050-0_15-MFG]
C69  0.47UF  [FP-C1005-050-0_15-MFG]
C70  0.47UF  [FP-C1005-050-0_15-MFG]
C71  100UF  [CAPC3216X190X55ML30T25]
C72  0.47UF  [FP-C1005-050-0_15-MFG]
C73  4.7UF  [FP-C1005-050-0_15-MFG]
C74  0.47UF  [FP-C1005-050-0_15-MFG]
C75  0.47UF  [FP-C1005-050-0_15-MFG]
C76  100UF  [CAPC3216X190X55ML30T25]
C78  4.7UF  [FP-C1005-050-0_15-MFG]
C85  47UF  [TAYO-JMK212BBJ476MG-T_L]
C90  0.47UF  [FP-C1005-050-0_15-MFG]
C93  0.47uF  [FP-C1005-050-0_15-MFG]
C98  0.1uF  [CAPC0603X33N]
C174  4.7UF  [FP-C1005-050-0_15-MFG]
C178  0.47UF  [FP-C1005-050-0_15-MFG]
DS1  LTST-S220TBKT  [CAPC2012X94N]
DS2  LTST-S220TBKT  [CAPC2012X94N]
E1  100OHM L0805  [TDK-MPZ2012S101A-2_V]
E5  100OHM L0805  [TDK-MPZ2012S101A-2_V]
E6  100OHM L0805  [TDK-MPZ2012S101A-2_V]
Q1  BSS138LT1G  [ONSC-SOT-23-3-318-08_V]
Q4  BSS138LT1G  [ONSC-SOT-23-3-318-08_V]
R11  4.7K  [2-0402]
R45  MC00625W040210R  [RESC1005X40X25NL10T10]
R46  4.7K  [2-0402]
R47  4.7K  [2-0402]
R48  470  [2-0402]
R66  20K  [2-0402]
R75  10K  [2-0402]
R87  470  [2-0402]
R91  4.7K  [2-0402]
U4  XC7Z010-1CLG225C  [BGA225C80P15X15_1300X1300X150]  (parts A,F of 6)

### Blocks framed on the sheet
VCCO DDR DECOUPLING: C54-C61
LED Package 0805: DS2 Q4 R75 R87

### Nets
GND: C49.2 C50.2 C51.2 C52.2 C53.2 C54.1 C55.2 C56.2 C57.2 C58.2 C59.2 C60.2 C61.2 C64.1 C65.2 C66.2 C67.2 C68.2 C69.2 C70.2 C71.1 C72.2 C73.2 C74.2 C75.2 C76.2 C78.2 C85.1 C90.2 C174.2 C178.2 E6.2 Q1.2(S) Q4.2(S) R66.2 R75.2 R91.2 U4.A1(GND) U4.A11(GND) U4.B8(GND) U4.C5(GND) U4.C15(GND) U4.D2(GND) U4.D12(GND) U4.E5(GND) U4.E7(GND) U4.E8(RSVDGND) U4.E9(GND) U4.F10(GND) U4.G3(GND) U4.G5(GND) U4.G13(GND) U4.H6(GND) U4.H8(VN_0) U4.H10(GND) U4.J5(GND) U4.J9(GND) U4.K4(GND) U4.K7(GND) U4.K10(GND) U4.K14(GND) U4.L1(GND) U4.L5(GND) U4.L11(GND) U4.M8(GND) U4.N5(GND) U4.N15(GND) U4.P2(GND) U4.P12(GND) U4.R9(GND)
1v8: C49.1 C50.1 C51.1 C52.1 C53.1 C65.1 C67.1 C69.1 C76.1 C78.1 C90.1 C174.1 E1.1 E5.2 R11.1 R45.1 R46.1 R47.1 U4.A6(VCCO_MIO0_500) U4.C10(VCCO_MIO1_501) U4.D7(VCCO_MIO0_500) U4.E14(VCCO_MIO1_501) U4.F11(VCCO_35) U4.G4(RSVDVCC1) U4.H4(RSVDVCC3) U4.H9(VCCAUX) U4.H15(VCCO_35) U4.J4(RSVDVCC2) U4.J6(VCCPAUX) U4.J8(VCCAUX) U4.J12(VCCO_34) U4.K8(VCCO_0) U4.K9(VCCAUX) U4.L6(VCCPAUX) U4.M13(VCCO_34) U4.N10(VCCO_34) U4.P7(VCCO_34) U4.R14(VCCO_34)
1v35: C54.2 C55.1 C56.1 C57.1 C58.1 C59.1 C60.1 C61.1 U4.B3(VCCO_DDR_502) U4.E4(VCCO_DDR_502) U4.F1(VCCO_DDR_502) U4.J2(VCCO_DDR_502) U4.M3(VCCO_DDR_502) U4.R4(VCCO_DDR_502)
BANK0A: C93.2 C98.2 E5.1 U4.F7(VCCADC_0)
BANK0B: C93.1 C98.1 E6.1 U4.F6(CFGBVS_0) U4.F8(GNDADC_0) U4.G8(VREFN_0) U4.H7(VREFP_0) U4.J7(DXP_0)
JTAG_TCK: U4.G9(TCK_0)
JTAG_TDI: U4.L7(TDI_0)
JTAG_TDO: U4.L8(TDO_0)
JTAG_TMS: U4.L9(TMS_0)
USR_LED: Q4.1(G) R75.1
VCCPINT: C64.2 C66.1 C68.1 C70.1 C71.2 C72.1 C73.1 C74.1 C75.1 U4.E10(VCCINT) U4.F9(VCCINT) U4.G6(VCCPINT) U4.G10(VCCINT) U4.H5(VCCPINT) U4.J10(VCCINT) U4.K5(VCCPINT) U4.L10(VCCINT)
VCCPLL: C85.2 C178.1 E1.2 U4.F5(VCCPLL)
VIN: DS1.1(A) DS2.1(A)
VTTVREF: U4.F4(PS_DDR_VREF0_502)
NetDS1_2: DS1.2(K) R48.1
NetDS2_2: DS2.2(K) R87.1
NetQ1_1: Q1.1(G) U4.M7(DONE_0)
NetQ1_3: Q1.3(D) R48.2
NetQ4_3: Q4.3(D) R87.2
NetR11_2: R11.2 R66.1 R91.1 U4.G7(VP_0)
NetR45_2: R45.2 U4.E6(VCCBATT_0)
NetR46_2: R46.2 U4.K6(PROGRAM_B_0)
NetR47_2: R47.2 U4.D5(INIT_B_0)

Not connected (* = marked no-connect by the designer): U4 B13(VCCO_MIO1_501)

### Notes on the sheet
- ZYNQ POWER
- ZYNQ BANK 0
- (near DS1) LED Package 0805
- PLACE NEAR XC7Z010 (VCCO_DDR)
- VCC AUX DECOUPLING
- VCC INT DECOUPLING
- VCCO PAUX DECOUPLING
- PLACE NEAR XC7Z010 (VCC_AUX)
- PLACE NEAR XC7Z010 (VCC_INT)
- PLACE NEAR XC7Z010 (VCCO_MIO0)
- VCC PINT DECOUPLING
- VCC PLL FILTERING
- VCC PAUX DECOUPLING
- PLACE NEAR XC7Z010 (VCC_PINT)
- (near E1) PLACE NEAR XC7Z010 (VCC_PLL)
- PLACE NEAR XC7Z010 (VCC_PAUX)
- PlutoV2 Schematic
- A
- R.Pender

### Library data of the parts
C49 C54 C64 C71 C76 = CMP-1662-00011-2: as C100 on sheet DDR3; REACH SVHC: No SVHC; Height: 1.6 mm; Tolerance: 20%; Packaging: Tape and Reel; Mount: Surface Mount; PackageDescription: 2-Pin Surface Mount Device, Body 3.2 x 1.6 mm; ComponentLink1URL: http://www.murata.com/; Pins: 2; ComponentLink2Description: Datasheet; PackageReference: 1206; Width: 1.6 mm; Package Quantity: 2000; Capacitance: 100 uF; Min Operating Temperature: -55 degC; Case Code (Imperial): 1206; Max Operating Temperature: 85 degC; DatasheetVersion: 09/2016; Mounting Technology: Surface Mount; Voltage Rating: 6.3 V; ComponentLink1Description: Manufacturer URL; Radiation Hardening: No; Case Code (Metric): 3216; Length: 3.2 mm; ComponentLink2URL: http://psearch.en.murata.com/capacitor/product/GRM31CR60J107ME39%23.pdf; RoHSCompliant: true
C50 C51 C55-C59 C66-C70 C72-C75 C78 C90 C93 C174 C178 = CMP-2000-05437-2: as C86 on sheet DDR3; Voltage: 6.3V; Capacitance: 4.7uF; Depth: 0.5mm; Height: 0.5mm; Length: 1mm; Termination: SMD/SMT; RoHS Compliant: Yes; Series: C; Case/Package: 0402; Dielectric: X5R; Lead Free: Lead Free; Mount: Surface Mount; Max Operating Temperature: 85°C; Min Operating Temperature: -55°C
C52 C60 C98 = GRM033R61C104ME84D: as C46 on sheet USB; Package: None; Price: None; Value: *; MP: GRM033R61C104ME84D; Availability: Unavailable
C53 C61 = GRM033R71A103KA01D: as C187 on sheet USB; Package: 0603 Taiyo Yuden; MP: GRM033R71A103KA01D; Value: *; SnapEDA_Link: https://www.snapeda.com/parts/GRM033R71A103KA01D/Murata/view-part/4379446/?ref=snap; Availability: Unavailable; Price: None; Check_prices: https://www.snapeda.com/parts/GRM033R71A103KA01D/Murata/view-part/4379446/?ref=eda
C65 C85 = CMP-2000-06498-1: High Value Multilayer Ceramic Capacitor, 47 uF, +/-20%, 6.3 V, -55 to 85 degC, 2-Pin SMD (0805), RoHS, Tape and Reel; Manufacturer: Taiyo Yuden; PCN Part Number: X5R,X7RDielectrics23/Jan/2008; Kits: 587-1797-KIT-ND-KITCAPCERHICAP0603&0805S; Temperature Coefficient: X5R; Tolerance: ±20%; Online Catalog: MSeries; Other Names: 587-1779-1; Capacitance: 47µF; Voltage - Rated: 6.3V; Catalog Drawings: xMKSeries_0805_1.25; Operating Temperature: -55°C~85°C; Mounting Technology: SurfaceMount; Package Reference: 0805; Features: -; Lead Spacing: -; Lead Style: -; Family: CeramicCapacitors; Size / Dimension: 0.079"Lx0.049"W(2.00mmx1.25mm); Package Description: 2-Pin SMD, Body 2.2 x 1.45 mm; Mounting Type: SurfaceMount,MLCC; Package / Case: 0805(2012Metric); Series: M; Category: Capacitors; Packaging: CutTape(CT); Datasheet Version: 10/2015; Datasheet URL: http://datasheet.octopart.com/JMK212BJ476MG-T-Taiyo-Yuden-datasheet-62109412.pdf; Manufacturer URL: http://www.t-yuden.com/; Ratings: -; Height - Seated (Max): -; Standard Package: 1; Thickness (Max): 0.053"(1.35mm); Applications: GeneralPurpose
DS1 DS2 = LED3: Typical BLUE SiC LED; Published: 8-Jun-2000; LatestRevisionDate: 17-Dec-2003; LatestRevisionNote: PCB Footprint replaced.; DatasheetVersion: 16-Apr-2002; PackageVersion: 16-Apr-2002; PackageReference: 3.5X2.8X1.9; Publisher: Altium Limited; PackageDescription: SM LED; 2 C-Bend Leads; Body 3.5 x 2.8 x 1.9 mm, inc leads (LxWxH typ)
E1 E5 E6 = CMP-2000-05399-1: Chip Bead for Power Line, 100 Ohm, +/- 25%, 4 A, -55 to 125 degC, 0805 (2012 Metric), RoHS, Tape and Reel; Manufacturer: TDK; Maximum DC Resistance: 20mOhms; Test Frequency: 100MHz; Impedance: 100Ohms; Case Width: 1.25mm; Case Length: 2mm; Maximum DC Current: 4A; Case Height: 0.85mm; Package Reference: MPZ2012S101A-2; RoHS: Details; Tolerance: 25%; Operating Temperature Range: -55Cto+125C; Datasheet Version: Jul-13; Dimensions: 1.25mmWx2mmLx0.85mmH; Product: FerriteChipBeads; Termination Style: SMD/SMT; Datasheet URL: http://www.farnell.com/datasheets/1750041.pdf; Factory Pack Quantity: 4000; Brand: TDK; Packaging: Reel; Package Description: 2-Pin Surface Mount Device, Body 2 x 1.25 mm; Product Category: EMIFilterBeads,Chips&Arrays; Manufacturer URL: http://www.tdk.com/; Package / Case: 0805(2012metric)
Q1 Q4 = CMP-1058-00767-1: Power MOSFET, 200 mA, 50 V, N-Channel, 3-Pin SOT-23, Pb-Free, Tape and Reel; Manufacturer: On Semiconductor; PD Max (W): 0.225; Coss Typ (pF): 12; V(BR)DSS Min (V): 50; VGS Max (V): 20; Channel Polarity: N Channel; Configuration: Single; VGS(th) Max (V): 1.5; Ciss Typ (pF): 40; Crss Typ (pF): 3.5; ID Max (A): 0.2; ComponentLink3Description: Package Specification; PackageDescription: 3-Pin Small Outline Transistor, Body 2.92 x 1.3 mm, Pitch 0.95 mm; PackageReference: SOT-23-3-318-08; RoHS: Pb-Free; Mounting Technology: Surface Mount; ComponentLink1Description: Manufacturer URL; ComponentLink2URL: http://www.onsemi.com/pub_link/Collateral/BSS138LT1-D.PDF; ComponentLink2Description: Datasheet; Packing: Tape and Reel; PackageVersion: Rev. AP, 11/2009; PartNumber: BSS138LT1G; Package Type: SOT-23-3; ComponentLink1URL: http://www.onsemi.com/; DatasheetVersion: Rev. 8; ComponentLink3URL: http://www.onsemi.cn/pub_link/Collateral/318-08.PDF
R11 R46 R47 R66 R75 R91 = ERJ2RK: as R13 on sheet USB; Published: 17-Dec-2003; LatestRevisionDate: 19-Mar-2004; LatestRevisionNote: Silkscreen size reduced.; PackageDocument: Mar-2003; PackageReference: 2-0402; Publisher: Altium Limited; Code_IPC: 1005 [0402]; ComponentLink1Description: Manufacturer Link; ComponentLink1URL: http://www.panasonic.com/industrial/components/resistive_products.htm; ComponentLink2Description: Datasheet; ComponentLink2URL: http://www.panasonic.com/industrial/components/pdf/AOA0000CE2.pdf
R45 = CMP-2002-05896-1: Manufacturer: Multicomp; Part Number: MC00625W040210R
R48 R87 = ERJ2GE: as R12 on sheet USB; Published: 17-Dec-2003; LatestRevisionDate: 19-Mar-2004; LatestRevisionNote: Silkscreen size reduced.; PackageDocument: Mar-2003; PackageReference: 2-0402; Publisher: Altium Limited; Code_IPC: 1005 [0402]; ComponentLink1Description: Manufacturer Link; ComponentLink1URL: http://www.panasonic.com/industrial/components/resistive_products.htm; ComponentLink2Description: Datasheet; ComponentLink2URL: http://www.panasonic.com/industrial/components/pdf/AOA0000CE1.pdf
U4 = XC7Z010-1CLG225C: as U4 on sheet USB; Value: *; SnapEDA_Link: https://www.snapeda.com/parts/XC7Z010-1CLG225C/Xilinx%20Inc./view-part/45778/?ref=snap; Digi-Key_Part_Number: 122-1855-ND; Package: CSPBGA-225 Xilinx; Digi-Key_Purchase_URL: https://www.digikey.by/product-detail/en/xilinx-inc/XC7Z010-1CLG225C/122-1855-ND/3925788?utm_source=snapeda&utm_medium=aggregator&utm_campaign=symbol; MP: XC7Z010-1CLG225C

## Sheet ZYNQ 34_35 and QPSI.SchDoc
size A3; SheetNumber: 5; SheetTotal: 14
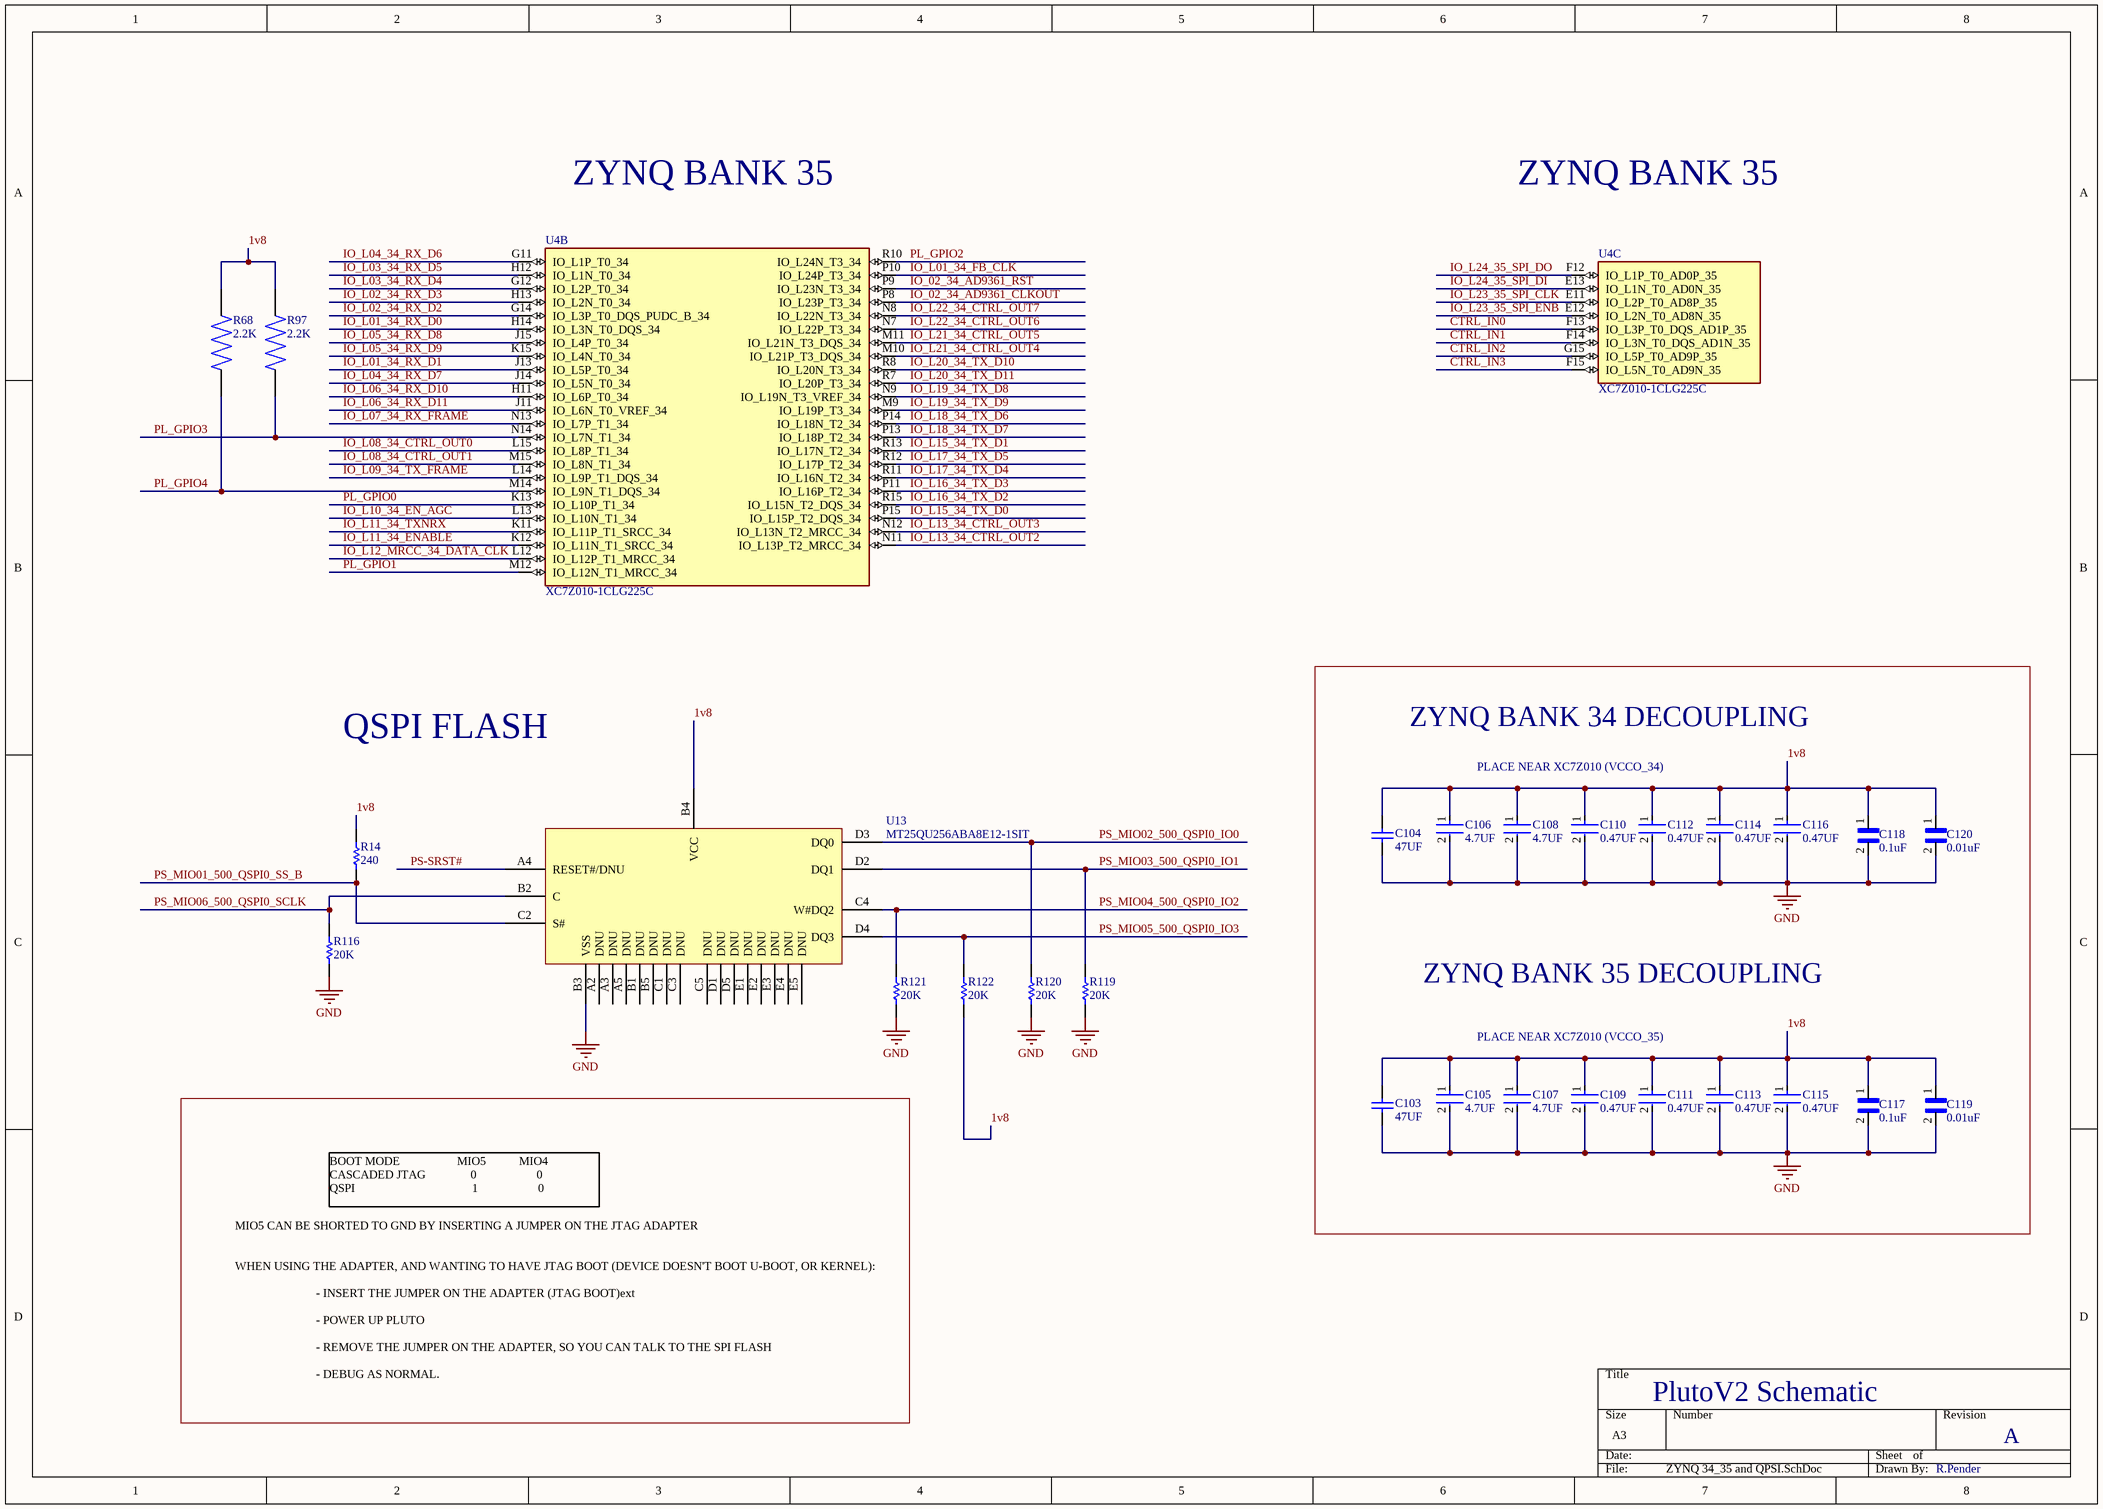
[diagram p4: ZYNQ 34_35 and QPSI.SchDoc]

### Parts
C103  47UF  [TAYO-JMK212BBJ476MG-T_L]
C104  47UF  [TAYO-JMK212BBJ476MG-T_L]
C105  4.7UF  [FP-C1005-050-0_15-MFG]
C106  4.7UF  [FP-C1005-050-0_15-MFG]
C107  4.7UF  [FP-C1005-050-0_15-MFG]
C108  4.7UF  [FP-C1005-050-0_15-MFG]
C109  0.47UF  [FP-C1005-050-0_15-MFG]
C110  0.47UF  [FP-C1005-050-0_15-MFG]
C111  0.47UF  [FP-C1005-050-0_15-MFG]
C112  0.47UF  [FP-C1005-050-0_15-MFG]
C113  0.47UF  [FP-C1005-050-0_15-MFG]
C114  0.47UF  [FP-C1005-050-0_15-MFG]
C115  0.47UF  [FP-C1005-050-0_15-MFG]
C116  0.47UF  [FP-C1005-050-0_15-MFG]
C117  0.1uF  [CAPC0603X33N]
C118  0.1uF  [CAPC0603X33N]
C119  0.01uF  [CAPC0603X33N]
C120  0.01uF  [CAPC0603X33N]
R14  240  [2-0402]
R68  2.2K  [RESC1005X35N]
R97  2.2K  [RESC1005X35N]
R116  20K  [2-0402]
R119  20K  [2-0402]
R120  20K  [2-0402]
R121  20K  [2-0402]
R122  20K  [2-0402]
U4  XC7Z010-1CLG225C  [BGA225C80P15X15_1300X1300X150]  (parts B,C of 6)
U13  MT25QU256ABA8E12-1SIT  [BGA25C100P5X5_800X600X120N]

### Nets
GND: C103.2 C104.2 C105.2 C106.2 C107.2 C108.2 C109.2 C110.2 C111.2 C112.2 C113.2 C114.2 C115.2 C116.2 C117.2 C118.2 C119.2 C120.2 R116.2 R119.2 R120.2 R121.2 U13.B3(VSS)
1v8: C103.1 C104.1 C105.1 C106.1 C107.1 C108.1 C109.1 C110.1 C111.1 C112.1 C113.1 C114.1 C115.1 C116.1 C117.1 C118.1 C119.1 C120.1 R14.1 R68.2 R97.2 R122.2 U13.B4(VCC)
CTRL_IN0: U4.F13(IO_L3P_T0_DQS_AD1P_35)
CTRL_IN1: U4.F14(IO_L3N_T0_DQS_AD1N_35)
CTRL_IN2: U4.G15(IO_L5P_T0_AD9P_35)
CTRL_IN3: U4.F15(IO_L5N_T0_AD9N_35)
IO_02_34_AD9361_CLKOUT: U4.P8(IO_L23P_T3_34)
IO_02_34_AD9361_RST: U4.P9(IO_L23N_T3_34)
IO_L01_34_FB_CLK: U4.P10(IO_L24P_T3_34)
IO_L01_34_RX_D0: U4.H14(IO_L3N_T0_DQS_34)
IO_L01_34_RX_D1: U4.J13(IO_L5P_T0_34)
IO_L02_34_RX_D2: U4.G14(IO_L3P_T0_DQS_PUDC_B_34)
IO_L02_34_RX_D3: U4.H13(IO_L2N_T0_34)
IO_L03_34_RX_D4: U4.G12(IO_L2P_T0_34)
IO_L03_34_RX_D5: U4.H12(IO_L1N_T0_34)
IO_L04_34_RX_D6: U4.G11(IO_L1P_T0_34)
IO_L04_34_RX_D7: U4.J14(IO_L5N_T0_34)
IO_L05_34_RX_D8: U4.J15(IO_L4P_T0_34)
IO_L05_34_RX_D9: U4.K15(IO_L4N_T0_34)
IO_L06_34_RX_D10: U4.H11(IO_L6P_T0_34)
IO_L06_34_RX_D11: U4.J11(IO_L6N_T0_VREF_34)
IO_L07_34_RX_FRAME: U4.N13(IO_L7P_T1_34)
IO_L08_34_CTRL_OUT0: U4.L15(IO_L8P_T1_34)
IO_L08_34_CTRL_OUT1: U4.M15(IO_L8N_T1_34)
IO_L09_34_TX_FRAME: U4.L14(IO_L9P_T1_DQS_34)
IO_L10_34_EN_AGC: U4.L13(IO_L10N_T1_34)
IO_L11_34_ENABLE: U4.K12(IO_L11N_T1_SRCC_34)
IO_L11_34_TXNRX: U4.K11(IO_L11P_T1_SRCC_34)
IO_L12_MRCC_34_DATA_CLK: U4.L12(IO_L12P_T1_MRCC_34)
IO_L13_34_CTRL_OUT2: U4.N11(IO_L13P_T2_MRCC_34)
IO_L13_34_CTRL_OUT3: U4.N12(IO_L13N_T2_MRCC_34)
IO_L15_34_TX_D0: U4.P15(IO_L15P_T2_DQS_34)
IO_L15_34_TX_D1: U4.R13(IO_L17N_T2_34)
IO_L16_34_TX_D2: U4.R15(IO_L15N_T2_DQS_34)
IO_L16_34_TX_D3: U4.P11(IO_L16P_T2_34)
IO_L17_34_TX_D4: U4.R11(IO_L16N_T2_34)
IO_L17_34_TX_D5: U4.R12(IO_L17P_T2_34)
IO_L18_34_TX_D6: U4.P14(IO_L18N_T2_34)
IO_L18_34_TX_D7: U4.P13(IO_L18P_T2_34)
IO_L19_34_TX_D8: U4.N9(IO_L19N_T3_VREF_34)
IO_L19_34_TX_D9: U4.M9(IO_L19P_T3_34)
IO_L20_34_TX_D10: U4.R8(IO_L20N_T3_34)
IO_L20_34_TX_D11: U4.R7(IO_L20P_T3_34)
IO_L21_34_CTRL_OUT4: U4.M10(IO_L21P_T3_DQS_34)
IO_L21_34_CTRL_OUT5: U4.M11(IO_L21N_T3_DQS_34)
IO_L22_34_CTRL_OUT6: U4.N7(IO_L22P_T3_34)
IO_L22_34_CTRL_OUT7: U4.N8(IO_L22N_T3_34)
IO_L23_35_SPI_CLK: U4.E11(IO_L2P_T0_AD8P_35)
IO_L23_35_SPI_ENB: U4.E12(IO_L2N_T0_AD8N_35)
IO_L24_35_SPI_DI: U4.E13(IO_L1N_T0_AD0N_35)
IO_L24_35_SPI_DO: U4.F12(IO_L1P_T0_AD0P_35)
PL_GPIO0: U4.K13(IO_L10P_T1_34)
PL_GPIO1: U4.M12(IO_L12N_T1_MRCC_34)
PL_GPIO2: U4.R10(IO_L24N_T3_34)
PL_GPIO3: R97.1 U4.N14(IO_L7N_T1_34)
PL_GPIO4: R68.1 U4.M14(IO_L9N_T1_DQS_34)
PS-SRST#: U13.A4(RESET#/DNU)
PS_MIO01_500_QSPI0_SS_B: R14.2 U13.C2(S#)
PS_MIO02_500_QSPI0_IO0: R120.1 U13.D3(DQ0)
PS_MIO03_500_QSPI0_IO1: R119.1 U13.D2(DQ1)
PS_MIO04_500_QSPI0_IO2: R121.1 U13.C4(W#DQ2)
PS_MIO05_500_QSPI0_IO3: R122.1 U13.D4(DQ3)
PS_MIO06_500_QSPI0_SCLK: R116.1 U13.B2(C)

Not connected (* = marked no-connect by the designer): U13 A2(DNU) A3(DNU) A5(DNU) B1(DNU) B5(DNU) C1(DNU) C3(DNU) C5(DNU) D1(DNU) D5(DNU) E1(DNU) E2(DNU) E3(DNU) E4(DNU) E5(DNU)

### Notes on the sheet
- ZYNQ BANK 35
- QSPI FLASH
- ZYNQ BANK 34 DECOUPLING
- PLACE NEAR XC7Z010 (VCCO_34)
- ZYNQ BANK 35 DECOUPLING
- PLACE NEAR XC7Z010 (VCCO_35)
- MIO5 CAN BE SHORTED TO GND BY INSERTING A JUMPER ON THE JTAG ADAPTER
- BOOT MODE                   MIO5           MIO4                      CASCADED JTAG               0                    0                                              QSPI                                       1                    0
- WHEN USING THE ADAPTER, AND WANTING TO HAVE JTAG BOOT (DEVICE DOESN'T BOOT U-BOOT, OR KERNEL):
- - INSERT THE JUMPER ON THE ADAPTER (JTAG BOOT)ext
- - POWER UP PLUTO
- - REMOVE THE JUMPER ON THE ADAPTER, SO YOU CAN TALK TO THE SPI FLASH
- - DEBUG AS NORMAL.
- PlutoV2 Schematic
- A
- R.Pender

### Library data of the parts
C103 C104 = CMP-2000-06498-1: as C65 on sheet ZYNQ JTAG and Decoupling; Operating Temperature: -55°C~85°C; Mounting Technology: SurfaceMount; Package Reference: 0805; Features: -; Lead Spacing: -; Lead Style: -; Family: CeramicCapacitors; Size / Dimension: 0.079"Lx0.049"W(2.00mmx1.25mm); Package Description: 2-Pin SMD, Body 2.2 x 1.45 mm; Mounting Type: SurfaceMount,MLCC; Package / Case: 0805(2012Metric); Series: M; Category: Capacitors; Packaging: CutTape(CT); Datasheet Version: 10/2015; Datasheet URL: http://datasheet.octopart.com/JMK212BJ476MG-T-Taiyo-Yuden-datasheet-62109412.pdf; Manufacturer URL: http://www.t-yuden.com/; Ratings: -; Height - Seated (Max): -; Standard Package: 1; Thickness (Max): 0.053"(1.35mm); Applications: GeneralPurpose
C105-C116 = CMP-2000-05437-2: as C86 on sheet DDR3; Voltage: 6.3V; Capacitance: 4.7uF; Depth: 0.5mm; Height: 0.5mm; Length: 1mm; Termination: SMD/SMT; RoHS Compliant: Yes; Series: C; Case/Package: 0402; Dielectric: X5R; Lead Free: Lead Free; Mount: Surface Mount; Max Operating Temperature: 85°C; Min Operating Temperature: -55°C
C117 C118 = GRM033R61C104ME84D: as C46 on sheet USB; Package: None; Price: None; Value: *; MP: GRM033R61C104ME84D; Availability: Unavailable
C119 C120 = GRM033R71A103KA01D: as C187 on sheet USB; Package: 0603 Taiyo Yuden; MP: GRM033R71A103KA01D; Value: *; SnapEDA_Link: https://www.snapeda.com/parts/GRM033R71A103KA01D/Murata/view-part/4379446/?ref=snap; Availability: Unavailable; Price: None; Check_prices: https://www.snapeda.com/parts/GRM033R71A103KA01D/Murata/view-part/4379446/?ref=eda
R14 R116 R119-R122 = ERJ2RK: as R13 on sheet USB; Published: 17-Dec-2003; LatestRevisionDate: 19-Mar-2004; LatestRevisionNote: Silkscreen size reduced.; PackageDocument: Mar-2003; PackageReference: 2-0402; Publisher: Altium Limited; Code_IPC: 1005 [0402]; ComponentLink1Description: Manufacturer Link; ComponentLink1URL: http://www.panasonic.com/industrial/components/resistive_products.htm; ComponentLink2Description: Datasheet; ComponentLink2URL: http://www.panasonic.com/industrial/components/pdf/AOA0000CE2.pdf
R68 R97 = CRCW04022K20FKEDC: 2.2 kOhms Â±1% 0.063W, 1/16W Chip Resistor 0402 _1005 Metric_ Thick Film; MF: Vishay; Price: None; Package: 1005 Yageo; Availability: Unavailable; SnapEDA_Link: https://www.snapeda.com/parts/CRCW04022K20FKEDC/Vishay/view-part/4129871/?ref=snap; Value: *; MP: CRCW04022K20FKEDC
U4 = XC7Z010-1CLG225C: as U4 on sheet USB; Value: *; SnapEDA_Link: https://www.snapeda.com/parts/XC7Z010-1CLG225C/Xilinx%20Inc./view-part/45778/?ref=snap; Digi-Key_Part_Number: 122-1855-ND; Package: CSPBGA-225 Xilinx; Digi-Key_Purchase_URL: https://www.digikey.by/product-detail/en/xilinx-inc/XC7Z010-1CLG225C/122-1855-ND/3925788?utm_source=snapeda&utm_medium=aggregator&utm_campaign=symbol; MP: XC7Z010-1CLG225C
U13 = Component_1